# EAGLE design InkTime (EAGLE 9.7.0)

## Sheet 1 of 2
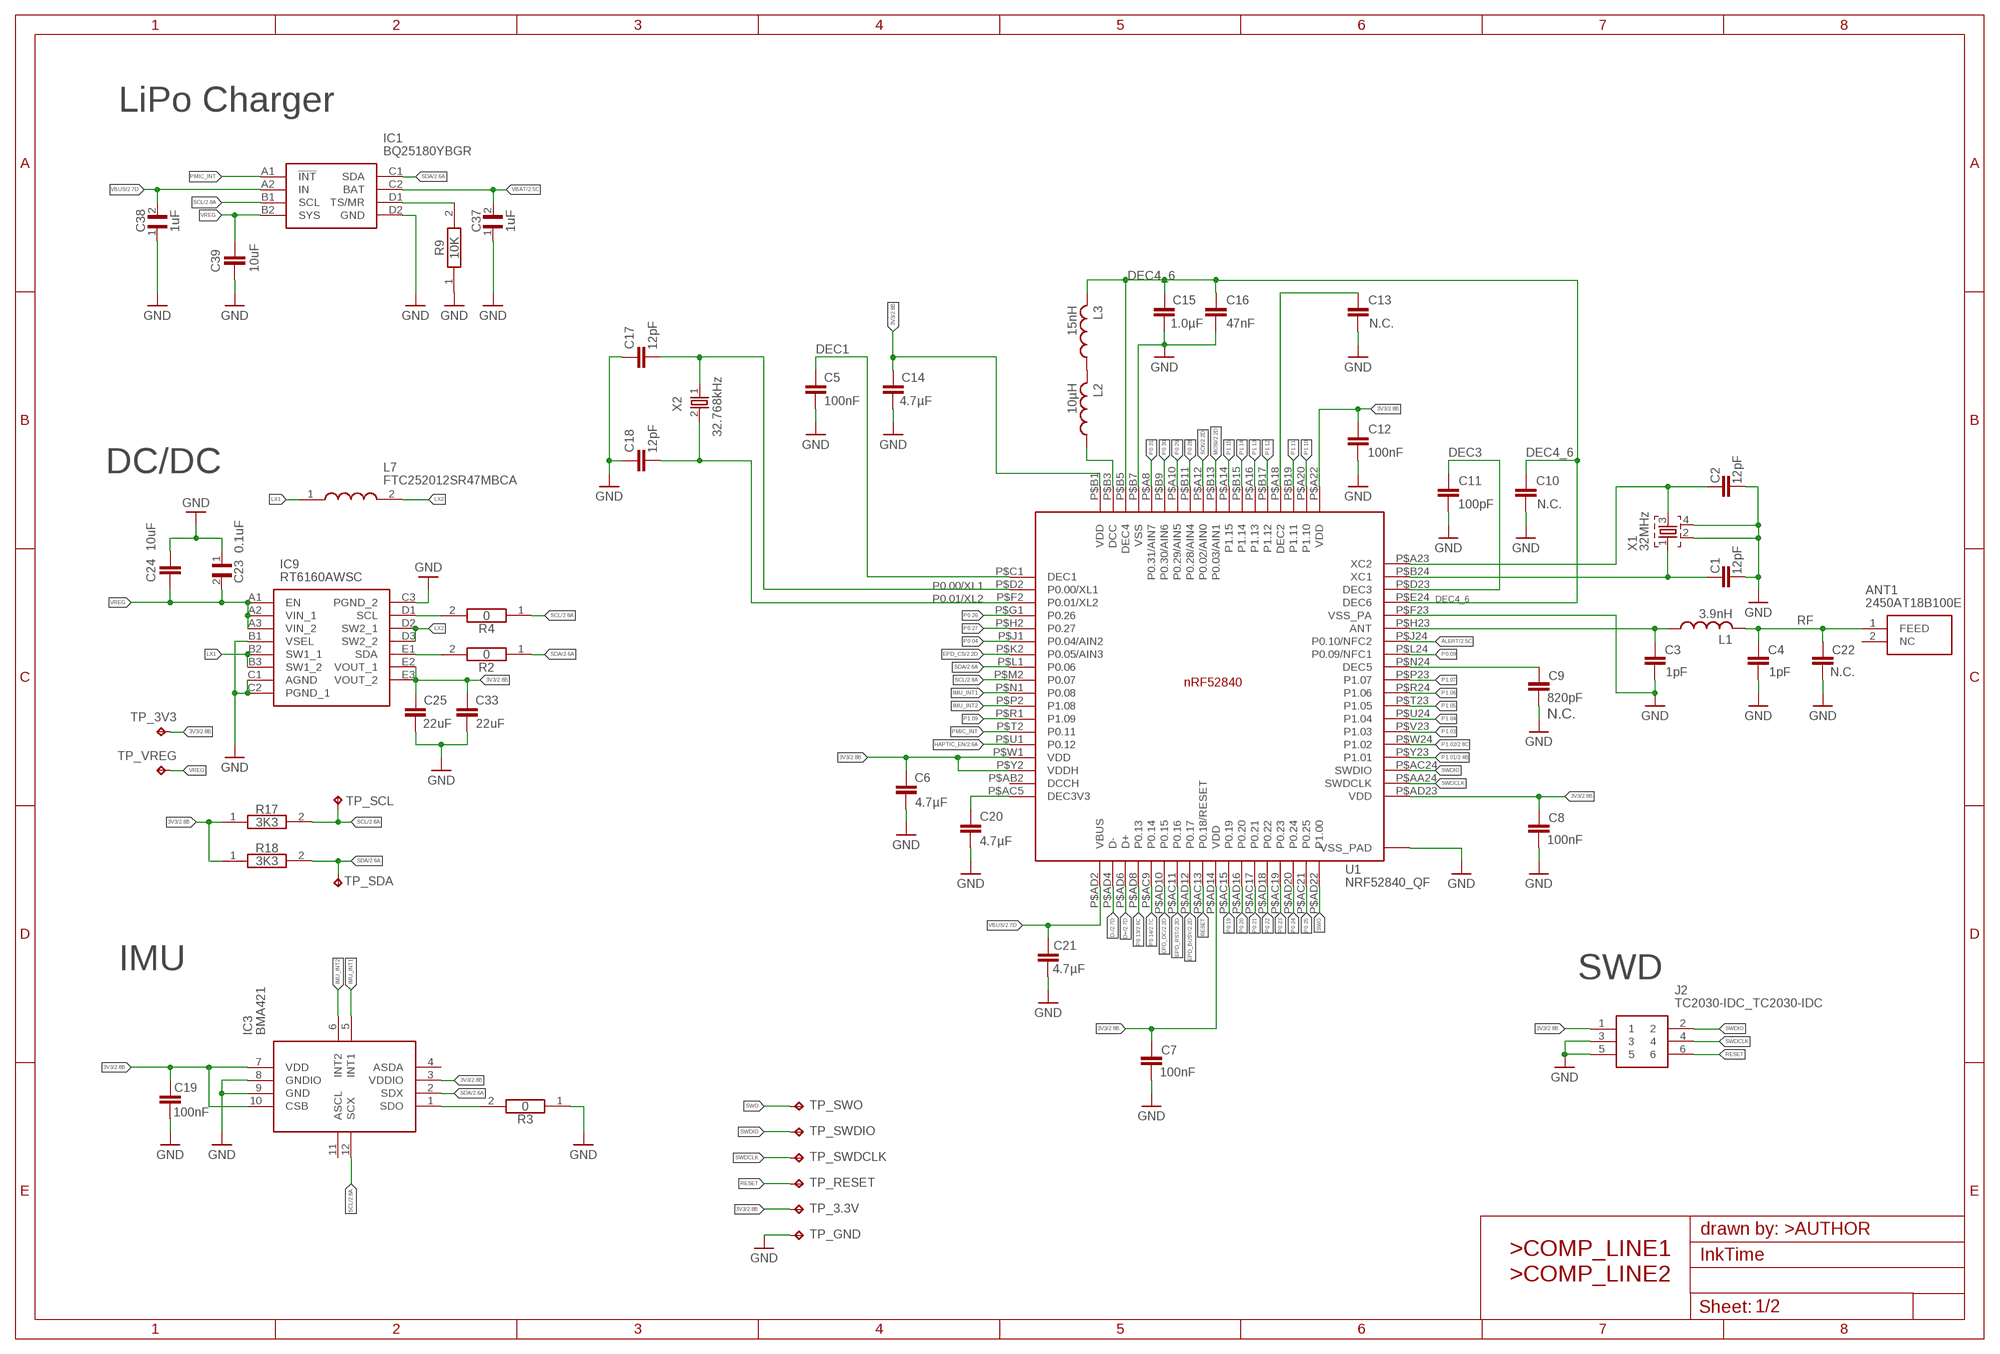
[diagram p0: schematic, sheet 1]
FRAME1 (FRAMES_A3L-LOC): AUTHOR: Robert Fabian Tudor; COMP_LINE1: MCU, Power,; COMP_LINE2: IMU, SWD

### Parts
ANT1  2450AT18B100E  2450AT18B100E_2450AT18B100E  [2450AT18B100E_ANTC3216X140N]
C1  12pF  NORDIC_NRF_3_CAPACITOR_0201_L  [NORDIC_NRF_3_RESC0201_L]
C2  12pF  NORDIC_NRF_3_CAPACITOR_0201_L  [NORDIC_NRF_3_RESC0201_L]
C3  1pF  NORDIC_NRF_3_CAPACITOR_0201_L  [NORDIC_NRF_3_RESC0201_L]
C4  1pF  NORDIC_NRF_3_CAPACITOR_0201_L  [NORDIC_NRF_3_RESC0201_L]
C5  100nF  NORDIC_NRF_3_CAPACITOR_0201_L  [NORDIC_NRF_3_RESC0201_L]
C6  4.7µF  NORDIC_NRF_3_CAPACITOR_0402_L  [NORDIC_NRF_3_RESC0402_L]
C7  100nF  NORDIC_NRF_3_CAPACITOR_0201_L  [NORDIC_NRF_3_RESC0201_L]
C8  100nF  NORDIC_NRF_3_CAPACITOR_0201_L  [NORDIC_NRF_3_RESC0201_L]
C9  820pF  NORDIC_NRF_3_CAPACITOR_0201_L  [NORDIC_NRF_3_RESC0201_L]
C10  N.C.  NORDIC_NRF_3_CAPACITOR_0201_L  [NORDIC_NRF_3_RESC0201_L]
C11  100pF  NORDIC_NRF_3_CAPACITOR_0201_L  [NORDIC_NRF_3_RESC0201_L]
C12  100nF  NORDIC_NRF_3_CAPACITOR_0201_L  [NORDIC_NRF_3_RESC0201_L]
C13  N.C.  NORDIC_NRF_3_CAPACITOR_0201_L  [NORDIC_NRF_3_RESC0201_L]
C14  4.7µF  NORDIC_NRF_3_CAPACITOR_0402_L  [NORDIC_NRF_3_RESC0402_L]
C15  1.0µF  NORDIC_NRF_3_CAPACITOR_0402_L  [NORDIC_NRF_3_RESC0402_L]
C16  47nF  NORDIC_NRF_3_CAPACITOR_0201_L  [NORDIC_NRF_3_RESC0201_L]
C17  12pF  NORDIC_NRF_3_CAPACITOR_0201_L  [NORDIC_NRF_3_RESC0201_L]
C18  12pF  NORDIC_NRF_3_CAPACITOR_0201_L  [NORDIC_NRF_3_RESC0201_L]
C19  100nF  NORDIC_NRF_3_CAPACITOR_0201_L  [NORDIC_NRF_3_RESC0201_L]
C20  4.7µF  NORDIC_NRF_3_CAPACITOR_0402_L  [NORDIC_NRF_3_RESC0402_L]
C21  4.7µF  NORDIC_NRF_3_CAPACITOR_0402_L  [NORDIC_NRF_3_RESC0402_L]
C22  N.C.  NORDIC_NRF_3_CAPACITOR_0201_L  [NORDIC_NRF_3_RESC0201_L]
C23  0.1uF  GRM011R60J152KE01L_1_GRM011R60J152KE01L  [GRM011R60J152KE01L_1_0201]
C24  10uF  NORDIC_NRF_3_CAPACITOR_0402_L  [NORDIC_NRF_3_RESC0402_L]
C25  22uF  NORDIC_NRF_3_CAPACITOR_0402_L  [NORDIC_NRF_3_RESC0402_L]
C33  22uF  NORDIC_NRF_3_CAPACITOR_0402_L  [NORDIC_NRF_3_RESC0402_L]
C37  1uF  GRM011R60J152KE01L_1_GRM011R60J152KE01L  [GRM011R60J152KE01L_1_0201]
C38  1uF  GRM011R60J152KE01L_1_GRM011R60J152KE01L  [GRM011R60J152KE01L_1_0201]
C39  10uF  NORDIC_NRF_3_CAPACITOR_0402_L  [NORDIC_NRF_3_RESC0402_L]
IC1  BQ25180YBGR  BQ25180YBGR_BQ25180YBGR  [BQ25180YBGR_BGA8C40P2X4_100X155X50]
IC3  BMA421  BMA423_BMA423  [BMA423_BMA423]
IC9  RT6160AWSC  RT6160AWSC_RT6160AWSC  [RT6160AWSC_BGA15C40P3X5_140X230X60]
J2  TC2030-IDC_TC2030-IDC  [TC2030-IDC_TC2030IDC]
L1  3.9nH  NORDIC_NRF_2_INDUCTOR_0402_L  [NORDIC_NRF_2_RESC0402_L]
L2  10µH  NORDIC_NRF_2_INDUCTOR_0402_L  [NORDIC_NRF_2_RESC0402_L]
L3  15nH  NORDIC_NRF_2_INDUCTOR_0402_L  [NORDIC_NRF_2_RESC0402_L]
L7  FTC252012SR47MBCA  MLP2016SR47MT0S1_FTC252012SR47MBCA  [MLP2016SR47MT0S1_INDC2016X100N]
R2  0  CPF0201D7K68C1_CPF0201D7K68C1  [CPF0201D7K68C1_0201]
R3  0  CPF0201D7K68C1_CPF0201D7K68C1  [CPF0201D7K68C1_0201]
R4  0  CPF0201D7K68C1_CPF0201D7K68C1  [CPF0201D7K68C1_0201]
R9  10K  CPF0201D7K68C1_CPF0201D7K68C1  [CPF0201D7K68C1_0201]
R17  3K3  CPF0201D7K68C1_CPF0201D7K68C1  [CPF0201D7K68C1_0201]
R18  3K3  CPF0201D7K68C1_CPF0201D7K68C1  [CPF0201D7K68C1_0201]
TP_3.3V  HECTOR_WATCH_1_TPTP20R  [HECTOR_WATCH_1_TP20R]
TP_3V3  HECTOR_WATCH_1_TPTP20R  [HECTOR_WATCH_1_TP20R]
TP_GND  HECTOR_WATCH_1_TPTP20R  [HECTOR_WATCH_1_TP20R]
TP_RESET  HECTOR_WATCH_1_TPTP20R  [HECTOR_WATCH_1_TP20R]
TP_SCL  HECTOR_WATCH_1_TPTP20R  [HECTOR_WATCH_1_TP20R]
TP_SDA  HECTOR_WATCH_1_TPTP20R  [HECTOR_WATCH_1_TP20R]
TP_SWDCLK  HECTOR_WATCH_1_TPTP20R  [HECTOR_WATCH_1_TP20R]
TP_SWDIO  HECTOR_WATCH_1_TPTP20R  [HECTOR_WATCH_1_TP20R]
TP_SWO  HECTOR_WATCH_1_TPTP20R  [HECTOR_WATCH_1_TP20R]
TP_VREG  HECTOR_WATCH_1_TPTP20R  [HECTOR_WATCH_1_TP20R]
U1  NRF52840_QF  NORDIC_NRF_4_NRF52840_QF  [NORDIC_NRF_4_AQFN50P700X700X85_HS-74N]
X1  32MHz  NORDIC_NRF_XTAL_32MHZ  [NORDIC_NRF_BT-XTAL_2016_N]
X2  32.768kHz  NORDIC_NRF_1_XTAL_32KHZ  [NORDIC_NRF_1_XTAL_3215_N]

### Nets
3V3: C6.1 C7.1 C8.1 C12.1 C14.1 C19.1 C25.1 C33.1 IC3.3(VDDIO) IC3.7(VDD) IC3.10(CSB) IC9.E2(VOUT_1) IC9.E3(VOUT_2) J2.1 R17.1 R18.1 TP_3.3V.TP TP_3V3.TP U1.P$A22(VDD) U1.P$AD14(VDD) U1.P$AD23(VDD) U1.P$B1(VDD) U1.P$W1(VDD) U1.P$Y2(VDDH) ; also sheet 2
ALERT: U1.P$J24(P0.10/NFC2) ; also sheet 2
D+: U1.P$AD6(D+) ; also sheet 2
D-: U1.P$AD4(D-) ; also sheet 2
EPD_BUSY: U1.P$AD12(P0.17) ; also sheet 2
EPD_CS: U1.P$K2(P0.05/AIN3) ; also sheet 2
EPD_DC: U1.P$AD10(P0.15) ; also sheet 2
EPD_RST: U1.P$AC11(P0.16) ; also sheet 2
GND: C1.2 C2.2 C3.2 C4.2 C5.2 C6.2 C7.2 C8.2 C9.2 C10.2 C11.2 C12.2 C13.2 C14.2 C15.2 C16.2 C17.1 C18.1 C19.2 C20.2 C21.2 C22.2 C23.1 C24.1 C25.2 C33.2 C37.1 C38.1 C39.2 IC1.D2(GND) IC3.8(GNDIO) IC3.9(GND) IC9.B1(VSEL) IC9.C1(AGND) IC9.C2(PGND_1) IC9.C3(PGND_2) J2.3 J2.5 R3.1 R9.1 TP_GND.TP U1.P$74(VSS_PAD) U1.P$75(VSS_PAD) U1.P$76(VSS_PAD) U1.P$77(VSS_PAD) U1.P$78(VSS_PAD) U1.P$79(VSS_PAD) U1.P$80(VSS_PAD) U1.P$81(VSS_PAD) U1.P$82(VSS_PAD) U1.P$83(VSS_PAD) U1.P$84(VSS_PAD) U1.P$85(VSS_PAD) U1.P$86(VSS_PAD) U1.P$87(VSS_PAD) U1.P$88(VSS_PAD) U1.P$89(VSS_PAD) U1.P$90(VSS_PAD) U1.P$B7(VSS) U1.P$F23(VSS_PA) X1.2 X1.4 ; also sheet 2
HAPTIC_EN: U1.P$U1(P0.12) ; also sheet 2
IMU_INT1: IC3.5(INT1) U1.P$N1(P0.08)
IMU_INT2: IC3.6(INT2) U1.P$P2(P1.08)
LX1: IC9.B2(SW1_1) IC9.B3(SW1_2) L7.1
LX2: IC9.D2(SW2_1) IC9.D3(SW2_2) L7.2
MOSI: U1.P$B13(P0.03/AIN1) ; also sheet 2
N$1: C9.1 U1.P$N24(DEC5)
N$2: C3.1 L1.1 U1.P$H23(ANT)
N$3: C13.1 U1.P$A18(DEC2)
N$4: L2.1 U1.P$B3(DCC)
N$6: IC1.D1(TS/MR) R9.2
N$7: C11.1 U1.P$D23(DEC3)
N$8: C1.1 U1.P$B24(XC1) X1.1
N$9: C2.1 U1.P$A23(XC2) X1.3
N$10: ANT1.1(FEED) C4.1 C22.1 L1.2
N$11: C10.1 C15.1 C16.1 L3.2 U1.P$B5(DEC4) U1.P$E24(DEC6)
N$12: L2.2 L3.1
N$13: C5.1 U1.P$C1(DEC1)
N$14: C17.2 U1.P$D2(P0.00/XL1) X2.1
N$15: C18.2 U1.P$F2(P0.01/XL2) X2.2
N$17: C20.1 U1.P$AC5(DEC3V3)
N$18: IC9.E1(SDA) R2.2
N$19: IC9.D1(SCL) R4.2
N$21: IC3.1(SDO) R3.2
P0.04: U1.P$J1(P0.04/AIN2)
P0.09: U1.P$L24(P0.09/NFC1)
P0.13: U1.P$AD8(P0.13) ; also sheet 2
P0.14: U1.P$AC9(P0.14) ; also sheet 2
P0.19: U1.P$AC15(P0.19)
P0.20: U1.P$AD16(P0.20)
P0.21: U1.P$AC17(P0.21)
P0.22: U1.P$AD18(P0.22)
P0.23: U1.P$AC19(P0.23)
P0.24: U1.P$AD20(P0.24)
P0.25: U1.P$AC21(P0.25)
P0.26: U1.P$G1(P0.26)
P0.27: U1.P$H2(P0.27)
P0.28: U1.P$B11(P0.28/AIN4)
P0.29: U1.P$A10(P0.29/AIN5)
P0.30: U1.P$B9(P0.30/AIN6)
P0.31: U1.P$A8(P0.31/AIN7)
P1.01: U1.P$Y23(P1.01) ; also sheet 2
P1.02: U1.P$W24(P1.02) ; also sheet 2
P1.03: U1.P$V23(P1.03)
P1.04: U1.P$U24(P1.04)
P1.05: U1.P$T23(P1.05)
P1.06: U1.P$R24(P1.06)
P1.07: U1.P$P23(P1.07)
P1.09: U1.P$R1(P1.09)
P1.10: U1.P$A20(P1.10)
P1.11: U1.P$B19(P1.11)
P1.12: U1.P$B17(P1.12)
P1.13: U1.P$A16(P1.13)
P1.14: U1.P$B15(P1.14)
P1.15: U1.P$A14(P1.15)
PMIC_INT: IC1.A1(!INT) U1.P$T2(P0.11)
RESET: J2.6 TP_RESET.TP U1.P$AC13(P0.18/RESET)
SCK: U1.P$A12(P0.02/AIN0) ; also sheet 2
SCL: IC1.B1(SCL) IC3.12(SCX) R4.1 R17.2 TP_SCL.TP U1.P$M2(P0.07) ; also sheet 2
SDA: IC1.C1(SDA) IC3.2(SDX) R2.1 R18.2 TP_SDA.TP U1.P$L1(P0.06) ; also sheet 2
SWDCLK: J2.4 TP_SWDCLK.TP U1.P$AA24(SWDCLK)
SWDIO: J2.2 TP_SWDIO.TP U1.P$AC24(SWDIO)
SWO: TP_SWO.TP U1.P$AD22(P1.00)
VBAT: C37.2 IC1.C2(BAT) ; also sheet 2
VBUS: C21.1 C38.2 IC1.A2(IN) U1.P$AD2(VBUS) ; also sheet 2
VREG: C23.2 C24.2 C39.1 IC1.B2(SYS) IC9.A1(EN) IC9.A2(VIN_1) IC9.A3(VIN_2) TP_VREG.TP
Unconnected: ANT1.2(NC) IC3.4(ASDA) IC3.11(ASCL) U1.P$AB2(DCCH)

### Notes on the sheet
- LiPo Charger
- DEC4_6
- DEC1
- DEC3 | DEC4_6
- DC/DC
- P0.00/XL1
- P0.01/XL2 | DEC4_6
- RF
- N.C.
- IMU | SWD

## Sheet 2 of 2
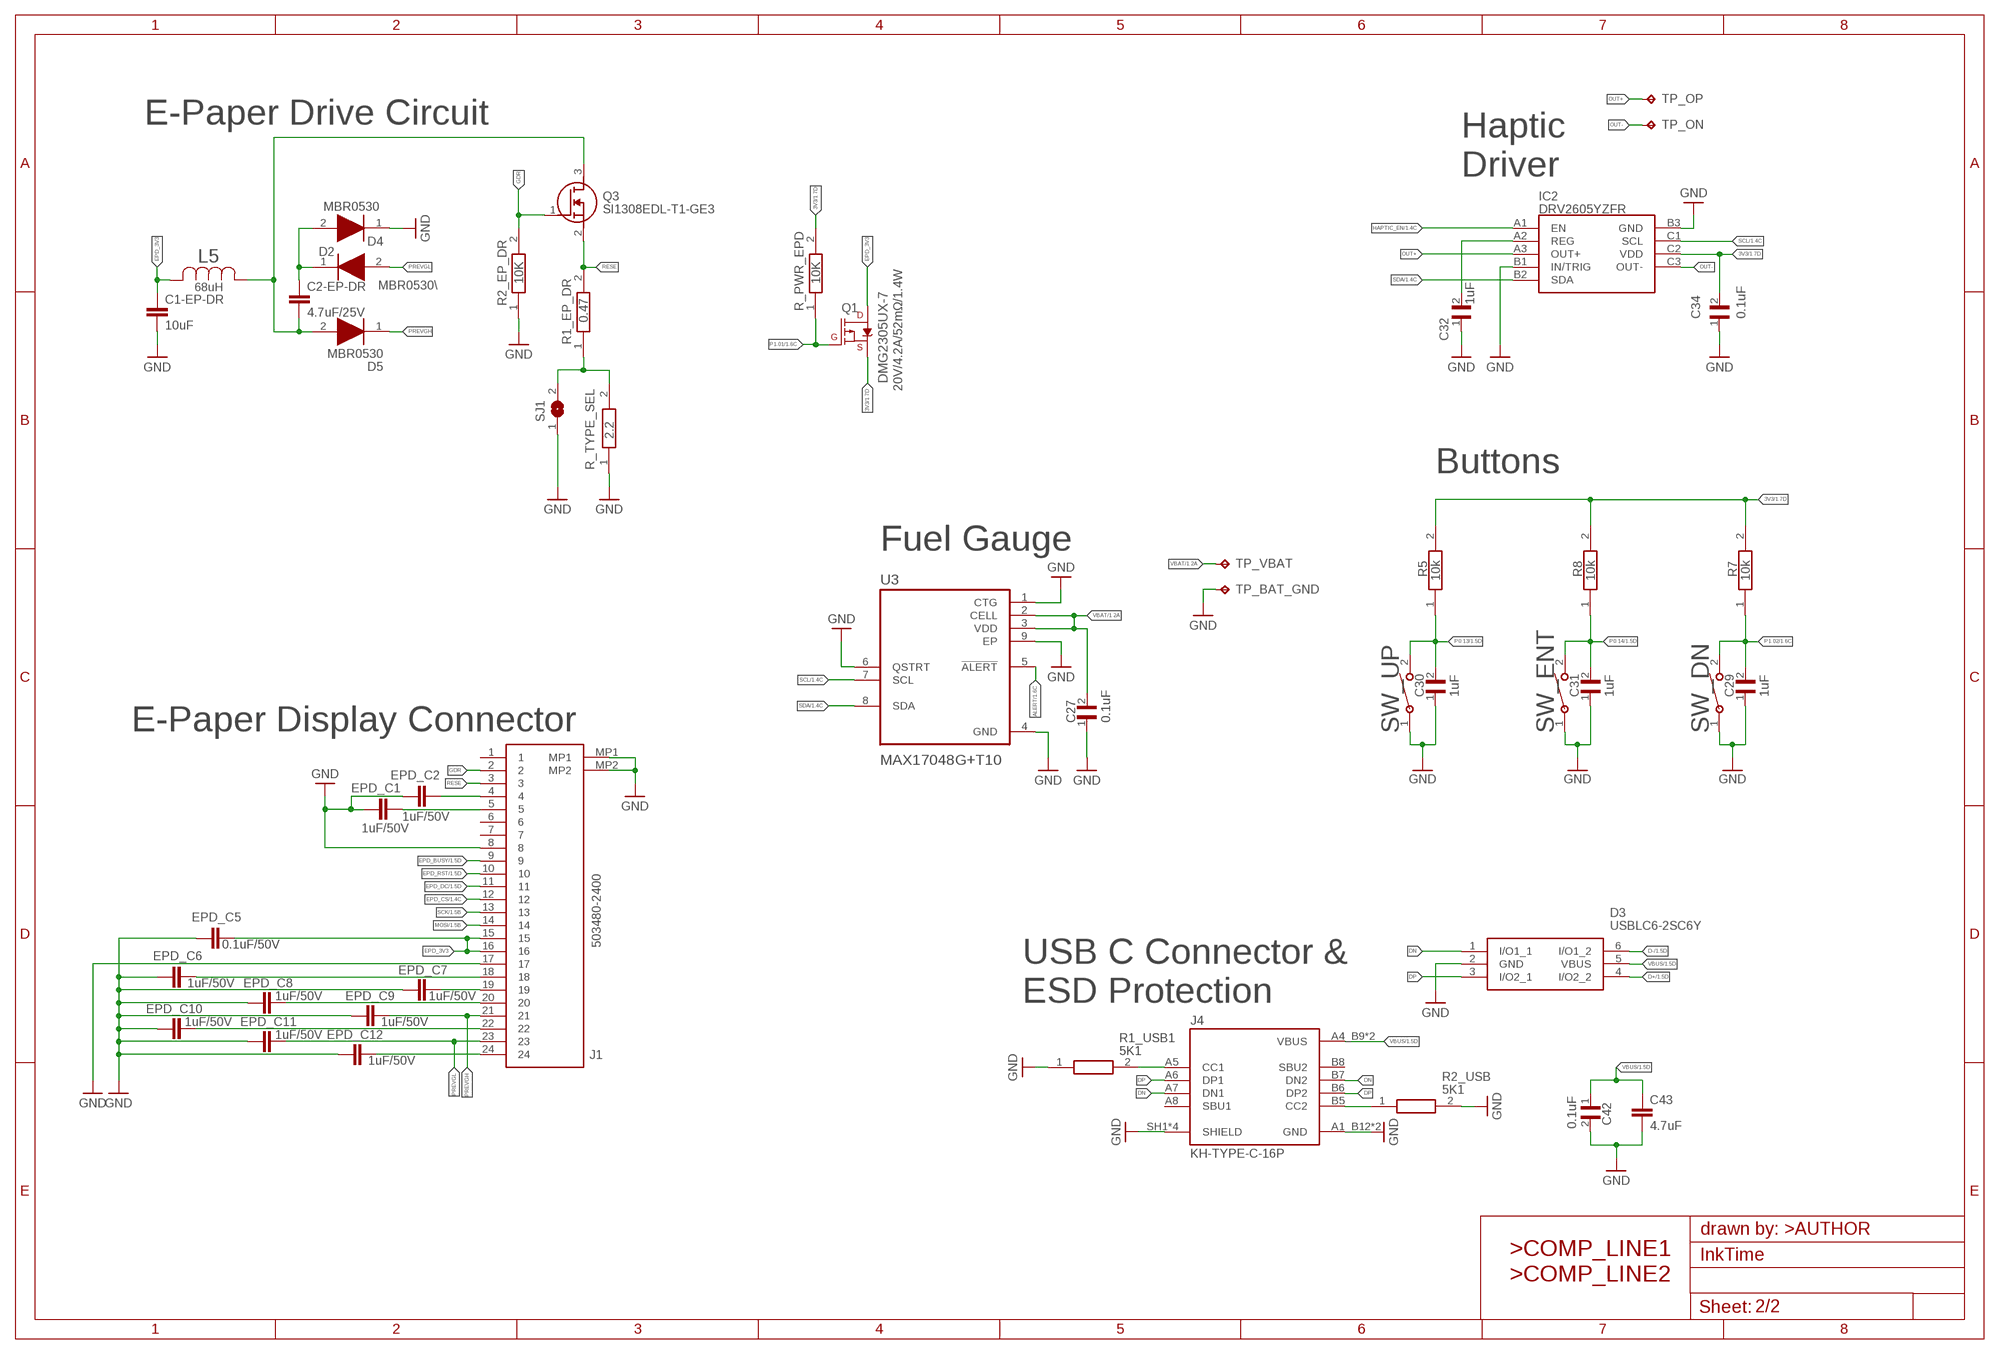
[diagram p1: schematic, sheet 2]
FRAME2 (FRAMES_A3L-LOC): AUTHOR: Robert Fabian Tudor; COMP_LINE1: E-Paper &; COMP_LINE2: Peripherals

### Parts
C1-EP-DR  10uF  NORDIC_NRF_3_CAPACITOR_0402_L  [NORDIC_NRF_3_RESC0402_L]
C2-EP-DR  4.7uF/25V  NORDIC_NRF_3_CAPACITOR_0402_L  [NORDIC_NRF_3_RESC0402_L]
C27  0.1uF  GRM011R60J152KE01L_1_GRM011R60J152KE01L  [GRM011R60J152KE01L_1_0201]
C29  1uF  GRM011R60J152KE01L_1_GRM011R60J152KE01L  [GRM011R60J152KE01L_1_0201]
C30  1uF  GRM011R60J152KE01L_1_GRM011R60J152KE01L  [GRM011R60J152KE01L_1_0201]
C31  1uF  GRM011R60J152KE01L_1_GRM011R60J152KE01L  [GRM011R60J152KE01L_1_0201]
C32  1uF  GRM011R60J152KE01L_1_GRM011R60J152KE01L  [GRM011R60J152KE01L_1_0201]
C34  0.1uF  GRM011R60J152KE01L_1_GRM011R60J152KE01L  [GRM011R60J152KE01L_1_0201]
C42  0.1uF  GRM011R60J152KE01L_1_GRM011R60J152KE01L  [GRM011R60J152KE01L_1_0201]
C43  4.7uF  NORDIC_NRF_3_CAPACITOR_0402_L  [NORDIC_NRF_3_RESC0402_L]
D2  MBR0530\  ESP32_C6_LIBRARY_5_MBR0530  [ESP32_C6_LIBRARY_5_SOD3716X135N]
D3  USBLC6-2SC6Y  ESP32_C6_LIBRARY_3_USBLC6-2SC6Y  [ESP32_C6_LIBRARY_3_SOT95P280X145-6N]
D4  MBR0530  ESP32_C6_LIBRARY_5_MBR0530  [ESP32_C6_LIBRARY_5_SOD3716X135N]
D5  MBR0530  ESP32_C6_LIBRARY_5_MBR0530  [ESP32_C6_LIBRARY_5_SOD3716X135N]
EPD_C1  1uF/50V  NORDIC_NRF_3_CAPACITOR_0402_L  [NORDIC_NRF_3_RESC0402_L]
EPD_C2  1uF/50V  NORDIC_NRF_3_CAPACITOR_0402_L  [NORDIC_NRF_3_RESC0402_L]
EPD_C5  0.1uF/50V  NORDIC_NRF_3_CAPACITOR_0201_L  [NORDIC_NRF_3_RESC0201_L]
EPD_C6  1uF/50V  NORDIC_NRF_3_CAPACITOR_0402_L  [NORDIC_NRF_3_RESC0402_L]
EPD_C7  1uF/50V  NORDIC_NRF_3_CAPACITOR_0402_L  [NORDIC_NRF_3_RESC0402_L]
EPD_C8  1uF/50V  NORDIC_NRF_3_CAPACITOR_0402_L  [NORDIC_NRF_3_RESC0402_L]
EPD_C9  1uF/50V  NORDIC_NRF_3_CAPACITOR_0402_L  [NORDIC_NRF_3_RESC0402_L]
EPD_C10  1uF/50V  NORDIC_NRF_3_CAPACITOR_0402_L  [NORDIC_NRF_3_RESC0402_L]
EPD_C11  1uF/50V  NORDIC_NRF_3_CAPACITOR_0402_L  [NORDIC_NRF_3_RESC0402_L]
EPD_C12  1uF/50V  NORDIC_NRF_3_CAPACITOR_0402_L  [NORDIC_NRF_3_RESC0402_L]
IC2  DRV2605YZFR  DRV2605YZFR_DRV2605YZFR  [DRV2605YZFR_BGA9C50P3X3_144X144X62]
J1  503480-2400  503480-2400_503480-2400  [503480-2400_5034802400]
J4  KH-TYPE-C-16P  KH-TYPE-C-16P_KH-TYPE-C-16P  [KH-TYPE-C-16P_KINGHELM_KH-TYPE-C-16P]
L5  68uH  ESP32_C6_LIBRARY_2_744043680IND_4828-WE-TPC_WRE  [ESP32_C6_LIBRARY_2_IND_4828-WE-TPC_WRE]
Q1  20V/4.2A/52mΩ/1.4W  ESP32_C6_LIBRARY_4_ESP32_WROVER_SPARKFUN-DISCRETESEMI_MOSFET_PCH-DMG2305UX-7  [ESP32_C6_LIBRARY_4_ESP32_C6_LIBRARY_4_ESP32_C6_LIBRARY_4_ESP32_C6_LIBRARY_4_ESP32_WROVER_SPARKFUN-DISCRETESEMI_SOT23-3]
Q3  SI1308EDL-T1-GE3  ESP32_C6_LIBRARY_6_SI1308EDL-T1-GE3  [ESP32_C6_LIBRARY_6_SOT65P210X110-3N]
R1_EP_DR  0.47  CPF0201D7K68C1_CPF0201D7K68C1  [CPF0201D7K68C1_0201]
R1_USB1  5K1  CPF0201D7K68C1_CPF0201D7K68C1  [CPF0201D7K68C1_0201]
R2_EP_DR  10K  CPF0201D7K68C1_CPF0201D7K68C1  [CPF0201D7K68C1_0201]
R2_USB  5K1  CPF0201D7K68C1_CPF0201D7K68C1  [CPF0201D7K68C1_0201]
R5  10k  CPF0201D7K68C1_CPF0201D7K68C1  [CPF0201D7K68C1_0201]
R7  10k  CPF0201D7K68C1_CPF0201D7K68C1  [CPF0201D7K68C1_0201]
R8  10k  CPF0201D7K68C1_CPF0201D7K68C1  [CPF0201D7K68C1_0201]
R_PWR_EPD  10K  CPF0201D7K68C1_CPF0201D7K68C1  [CPF0201D7K68C1_0201]
R_TYPE_SEL  2.2  CPF0201D7K68C1_CPF0201D7K68C1  [CPF0201D7K68C1_0201]
SJ1  ESP32_C6_LIBRARY_7_JUMPER_SJ  [ESP32_C6_LIBRARY_7_JUMPER_SJ]
SW_DN  2025-10-22_07-23-44_LIBRARY_EVP-AKE31ASW_EVP-AKE31A_PAN  [2025-10-22_07-23-44_LIBRARY_SW_EVP-AKE31A_PAN]
SW_ENT  2025-10-22_07-23-44_LIBRARY_EVP-AKE31ASW_EVP-AKE31A_PAN  [2025-10-22_07-23-44_LIBRARY_SW_EVP-AKE31A_PAN]
SW_UP  2025-10-22_07-23-44_LIBRARY_EVP-AKE31ASW_EVP-AKE31A_PAN  [2025-10-22_07-23-44_LIBRARY_SW_EVP-AKE31A_PAN]
TP_BAT_GND  HECTOR_WATCH_1_TPTP20R  [HECTOR_WATCH_1_TP20R]
TP_ON  HECTOR_WATCH_1_TPTP20R  [HECTOR_WATCH_1_TP20R]
TP_OP  HECTOR_WATCH_1_TPTP20R  [HECTOR_WATCH_1_TP20R]
TP_VBAT  HECTOR_WATCH_1_TPTP20R  [HECTOR_WATCH_1_TP20R]
U3  MAX17048G+T10  ESP32_C6_LIBRARY_MAX17048G+T10  [ESP32_C6_LIBRARY_SON50P200X200X80-9N]

### Nets
3V3: C34.2 IC2.C2(VDD) Q1.2(S) R5.2 R7.2 R8.2 R_PWR_EPD.2 ; also sheet 1
ALERT: U3.5(!ALERT) ; also sheet 1
D+: D3.4(I/O2_2) ; also sheet 1
D-: D3.6(I/O1_2) ; also sheet 1
DN: D3.1(I/O1_1) J4.A7(DN1) J4.B7(DN2)
DP: D3.3(I/O2_1) J4.A6(DP1) J4.B6(DP2)
EPD_3V3: C1-EP-DR.2 EPD_C5.2 J1.15 J1.16 L5.2 Q1.3(D)
EPD_BUSY: J1.9 ; also sheet 1
EPD_CS: J1.12 ; also sheet 1
EPD_DC: J1.11 ; also sheet 1
EPD_RST: J1.10 ; also sheet 1
GDR: J1.2 Q3.1(G) R2_EP_DR.2
GND: C1-EP-DR.1 C27.1 C29.1 C30.1 C31.1 C32.1 C34.1 C42.2 C43.2 D3.2(GND) D4.1(K) EPD_C1.1 EPD_C2.1 EPD_C5.1 EPD_C6.1 EPD_C7.1 EPD_C8.1 EPD_C9.1 EPD_C10.1 EPD_C11.1 EPD_C12.1 IC2.B1(IN/TRIG) IC2.B3(GND) J1.8 J1.17 J1.MP1 J1.MP2 J4.A1_B12(GND) J4.A12_B1(GND) J4.SH1(SHIELD) J4.SH2(SHIELD) J4.SH3(SHIELD) J4.SH4(SHIELD) R1_USB1.1 R2_EP_DR.1 R2_USB.2 R_TYPE_SEL.1 SJ1.1 SW_DN.1 SW_ENT.1 SW_UP.1 TP_BAT_GND.TP U3.1(CTG) U3.4(GND) U3.6(QSTRT) U3.9(EP) ; also sheet 1
HAPTIC_EN: IC2.A1(EN) ; also sheet 1
MOSI: J1.14 ; also sheet 1
N$5: C32.2 IC2.A2(REG)
N$20: J4.B5(CC2) R2_USB.1
N$22: J4.A5(CC1) R1_USB1.2
N$23: EPD_C2.2 J1.4
N$24: EPD_C6.2 J1.18
N$25: EPD_C1.2 J1.5
N$26: EPD_C7.2 J1.19
N$27: EPD_C8.2 J1.20
N$29: EPD_C10.2 J1.22
N$31: EPD_C12.2 J1.24
N$32: C2-EP-DR.1 D5.2(A) L5.1 Q3.3(D)
N$33: R1_EP_DR.1 R_TYPE_SEL.2 SJ1.2
N$34: C2-EP-DR.2 D2.1(K) D4.2(A)
OUT+: IC2.A3(OUT+) TP_OP.TP
OUT-: IC2.C3(OUT-) TP_ON.TP
P0.13: C30.2 R5.1 SW_UP.2 ; also sheet 1
P0.14: C31.2 R8.1 SW_ENT.2 ; also sheet 1
P1.01: Q1.1(G) R_PWR_EPD.1 ; also sheet 1
P1.02: C29.2 R7.1 SW_DN.2 ; also sheet 1
PREVGH: D5.1(K) EPD_C9.2 J1.21
PREVGL: D2.2(A) EPD_C11.2 J1.23
RESE: J1.3 Q3.2(S) R1_EP_DR.2
SCK: J1.13 ; also sheet 1
SCL: IC2.C1(SCL) U3.7(SCL) ; also sheet 1
SDA: IC2.B2(SDA) U3.8(SDA) ; also sheet 1
VBAT: C27.2 TP_VBAT.TP U3.2(CELL) U3.3(VDD) ; also sheet 1
VBUS: C42.1 C43.1 D3.5(VBUS) J4.A4_B9(VBUS) J4.A9_B4(VBUS) ; also sheet 1
Unconnected: J1.1 J1.6 J1.7 J4.A8(SBU1) J4.B8(SBU2)

### Notes on the sheet
- E-Paper Drive Circuit
- Haptic
  Driver
- DMG2305UX-7
- Buttons
- Fuel Gauge
- E-Paper Display Connector
- USB C Connector & 
  ESD Protection

## Library data of the parts
ANT1 = Library_Project_TSC:2450AT18B100E_2450AT18B100E: Antennas 2.45GHz ANTENNA Source: Datasheet <https://www.johansontechnology.com/datasheets/2450AT18B100/2450AT18B100.pdf>
C1 C1-EP-DR C2 C2-EP-DR C3-C22 C24 C25 C33 C39 C43 EPD_C1 EPD_C2 EPD_C5-EPD_C12 = Library_Project_TSC:NORDIC_NRF_3_CAPACITOR: Generic chip capacitor
C23 C27 C29-C32 C34 C37 C38 C42 = Library_Project_TSC:GRM011R60J152KE01L_1_GRM011R60J152KE01L: Check availability <https://pricing.snapeda.com/parts/GRM011R60J152KE01L/Murata/view-part?ref=eda>
D2 D4 D5 = Library_Project_TSC:ESP32_C6_LIBRARY_5_MBR0530: ON SEMICONDUCTOR - MBR0530 - DIODE, SCHOTTKY, 0.5A, 30V, SOD-123 Source: Datasheet <http://www.onsemi.com/pub/Collateral/MBR0530T1-D.PDF> Check availability <https://pricing.snapeda.com/parts/MBR0530/ON%20Semiconductor/view-part?ref=eda>
D3 = Library_Project_TSC:ESP32_C6_LIBRARY_3_USBLC6-2SC6Y: Low Cap. ESD Protection Auto SOT-23-6 STMicroelectronics USBLC6-2SC6Y, Dual Uni-Directional TVS Diode Array, 6-Pin SOT-23 Source: Datasheet <https://componentsearchengine.com/Datasheets/1/USBLC6-2SC6Y.pdf> Check availability <https://pricing.snapeda.com/parts/USBLC6-2SC6Y/STMicroelectronics/view-part?ref=eda>
IC1 = Library_Project_TSC:BQ25180YBGR_BQ25180YBGR: Charger IC Lithium Ion/Polymer, Lithium Iron Phosphate 8-DSBGA (1.6x1.1) Source: Datasheet <https://www.ti.com/lit/ds/symlink/bq25180.pdf?ts=1650264094470&ref_url=https%3A%2F%2Fwww.ti.com%2Fproduct%2FBQ25180>
IC2 = Library_Project_TSC:DRV2605YZFR_DRV2605YZFR: Haptic Driver for ERM/LRA with Built-In Library and Smart Loop Architecture Source: Datasheet <http://www.ti.com/lit/gpn/drv2605>
IC3 = Library_Project_TSC:BMA423_BMA423: Accelerometers Triaxial low-g 12bit Acceleration Sensor Source: Datasheet <https://www.mouser.com/datasheet/2/783/BST-BMA423-DS000-1509600.pdf>
IC9 = Library_Project_TSC:RT6160AWSC_RT6160AWSC: Buck-Boost Regulator Positive Output Step-Up/Step-Down I2C DC-DC Controller IC 15-WL-CSP (BSC) (1.4x2.3) Source: Datasheet <https://www.richtek.com/SaveDownload.aspx?specid=RT6160A>
J1 = Library_Project_TSC:503480-2400_503480-2400: FFC & FPC Connectors 0.5mm FPC RA SMT Dual Contact 24Ckt Source: Datasheet <https://componentsearchengine.com/Datasheets/1/503480-2400.pdf>
J2 = Library_Project_TSC:TC2030-IDC_TC2030-IDC: CABLE ADAPTER 6 POS Source: Datasheet <https://datasheet.datasheetarchive.com/originals/distributors/Datasheets_SAMA/62bc384e093448baaaa63dbd0b9d8707.pdf>
J4 = Library_Project_TSC:KH-TYPE-C-16P_KH-TYPE-C-16P: Check availability <https://pricing.snapeda.com/parts/KH-TYPE-C-16P/kinghelm/view-part?ref=eda>
L1-L3 = Library_Project_TSC:NORDIC_NRF_2_INDUCTOR: Generic chip inductor
L5 = Library_Project_TSC:ESP32_C6_LIBRARY_2_744043680
L7 = Library_Project_TSC:MLP2016SR47MT0S1_FTC252012SR47MBCA: SMD / SMT Inductors (Coils), L=0.47?H, L x W x T : Source: Datasheet <https://product.tdk.com/system/files/dam/doc/product/inductor/inductor/smd/catalog/inductor_commercial_power_mlp2016_en.pdf>
Q1 = Library_Project_TSC:ESP32_C6_LIBRARY_4_ESP32_WROVER_SPARKFUN-DISCRETESEMI_MOSFET_PCH: P-channel MOSFETs Voltage controlled devices that allow control of high current outputs. SparkFun Products: SparkFun ESP32 Thing <https://www.sparkfun.com/products/13907> SparkFun ESP8266 Thing <https://www.sparkfun.com/products/13231> SparkFun Pi Servo HAT V2 <https://www.sparkfun.com/products/15316> DMG2305UX-7 (20V/4.2A/SOT23-3)
Q3 = Library_Project_TSC:ESP32_C6_LIBRARY_6_SI1308EDL-T1-GE3: MOSFET N-Ch 30V 1.5A TrenchFET SC70 Vishay Si1308EDL-T1-GE3 N-channel MOSFET Transistor, 1.5 A, 30 V, 3-Pin SC-70 Source: Datasheet <https://componentsearchengine.com/Datasheets/1/SI1308EDL-T1-GE3.pdf> Check availability <https://pricing.snapeda.com/parts/SI1308EDL-T1-GE3/Vishay%20Siliconix/view-part?ref=eda>
R1_EP_DR R1_USB1 R2 R2_EP_DR R2_USB R3-R5 R7-R9 R17 R18 R_PWR_EPD R_TYPE_SEL = Library_Project_TSC:CPF0201D7K68C1_CPF0201D7K68C1: 7.68k 0201 Thin Film Surface Mount Fixed Resistor +/-0.5% 0.031W CPF0201D7K68C1 Source: Datasheet <http://www.te.com/commerce/DocumentDelivery/DDEController?Action=showdoc&DocId=Data Sheet1773200-1ApdfEnglishENG_DS_1773200-1_A.pdf4-2176215-6>
SJ1 = Library_Project_TSC:ESP32_C6_LIBRARY_7_JUMPER_SJ: SMD solder JUMPER
SW_DN SW_ENT SW_UP = Library_Project_TSC:2025-10-22_07-23-44_LIBRARY_EVP-AKE31A
TP_3.3V TP_3V3 TP_BAT_GND TP_GND TP_ON TP_OP TP_RESET TP_SCL TP_SDA TP_SWDCLK TP_SWDIO TP_SWO TP_VBAT TP_VREG = Library_Project_TSC:HECTOR_WATCH_1_TP: Test pad
U1 = Library_Project_TSC:NORDIC_NRF_4_NRF52840_QF: nRF52840 Features Advanced Single chip 2.4 GHz multi-protocol SoC 32-bit ARM Cortex-M4F Processor 1.7v to 5.5v operation 1MB flash + 256kB RAM Bluetooth 5 support for long range and high throughput 802.15.4 radio support On-chip NFC PPI –Programmable Peripheral Interconnect Automated power management system with automatic power management of each peripheral Configurable I/O mapping for analog and digital I/O 48 x GPIO 1 x QSPI 4 x Master/Slave SPI 2 x Two-wire interface (I²C) I²S interface 2 x UART 4 x PWM USB 2.0 controller ARM TrustZone CryptoCell-310 Cryptographic and security module AES 128-bit ECB/CCM/AAR hardware accelerator Digital microphone interface (PDM) Quadrature decoder 12-bit ADC Low power comparator On-chip 50Ω balun On-air compatible with nRF52, nRF51 and nRF24 Series Applications Advanced high performance wearables Wearables for secure payments Virtual Reality/Augmented Reality systems Smart Home sensor networks Smart city sensor networks High performance HID controllers Internet of Things (IoT) sensor networks Smart door locks Smart lighting networks Connected white goods
U3 = Library_Project_TSC:ESP32_C6_LIBRARY_MAX17048G+T10: Check availability <https://pricing.snapeda.com/parts/MAX17048G%2BT10/Analog%20Devices/view-part?ref=eda>
X1 = Library_Project_TSC:NORDIC_NRF_XTAL_32MHZ
X2 = Library_Project_TSC:NORDIC_NRF_1_XTAL_32KHZ

## Board
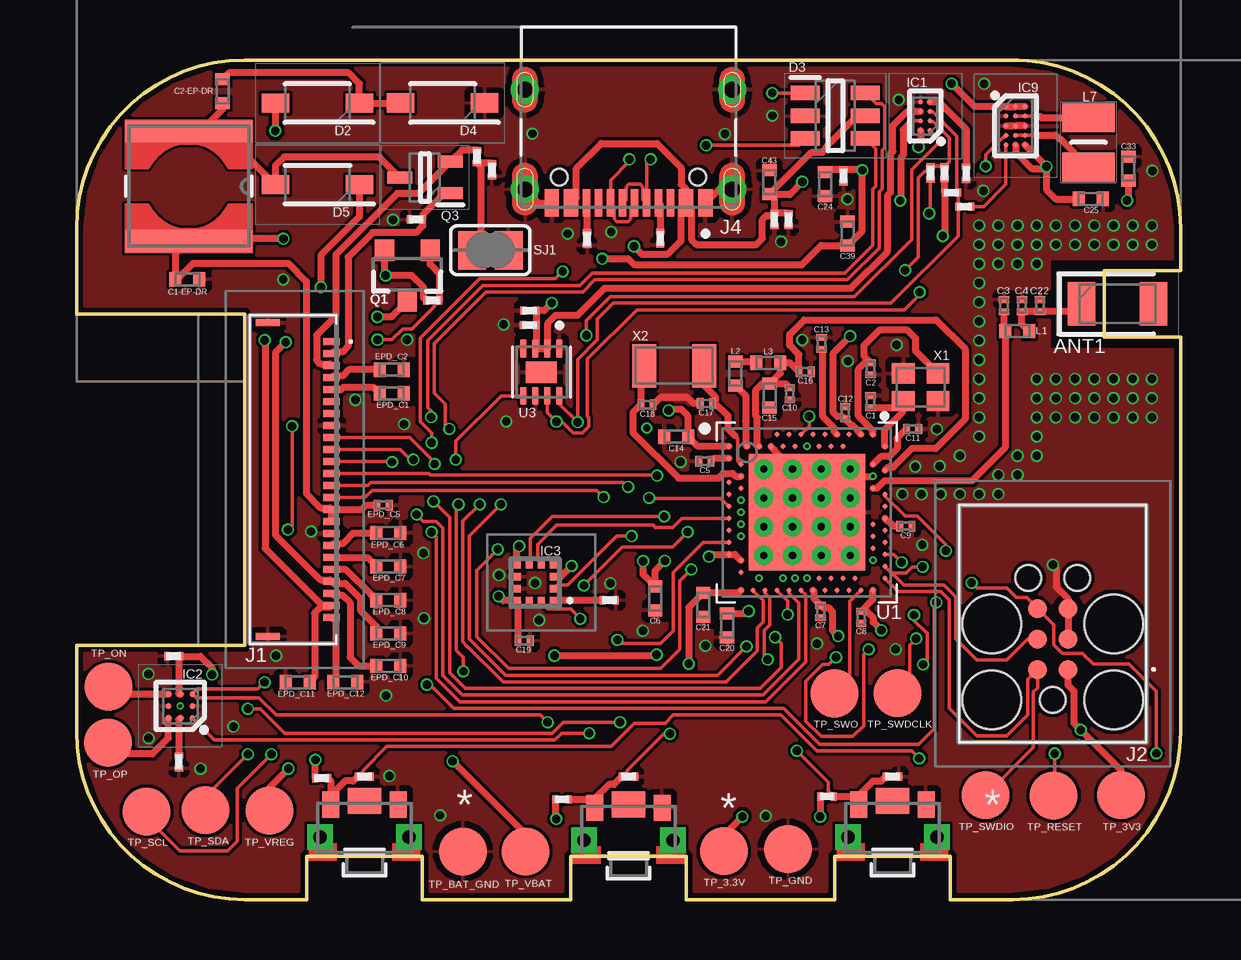
[diagram p2: board, top side]
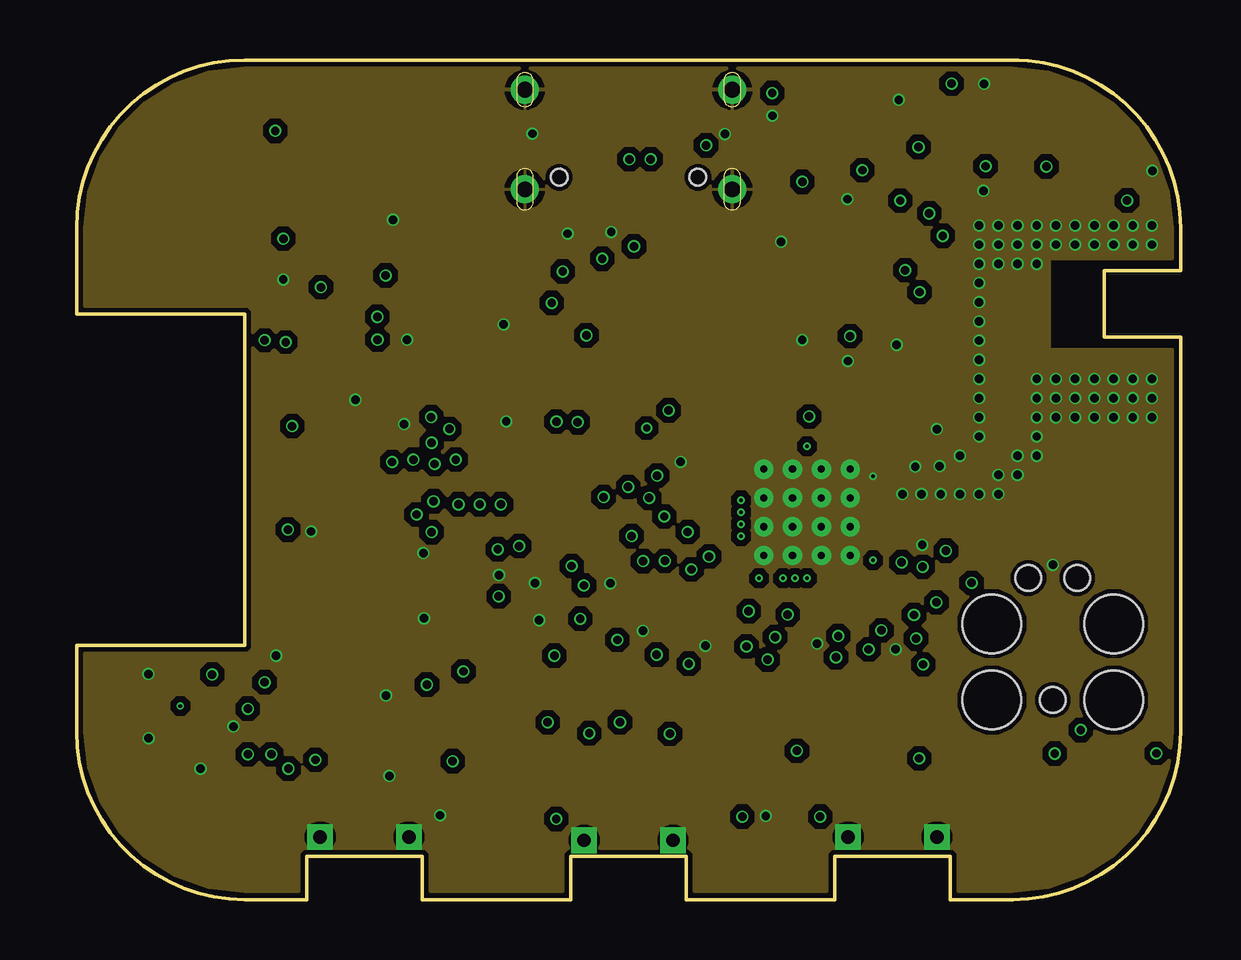
[diagram p3: board, inner layer GND]
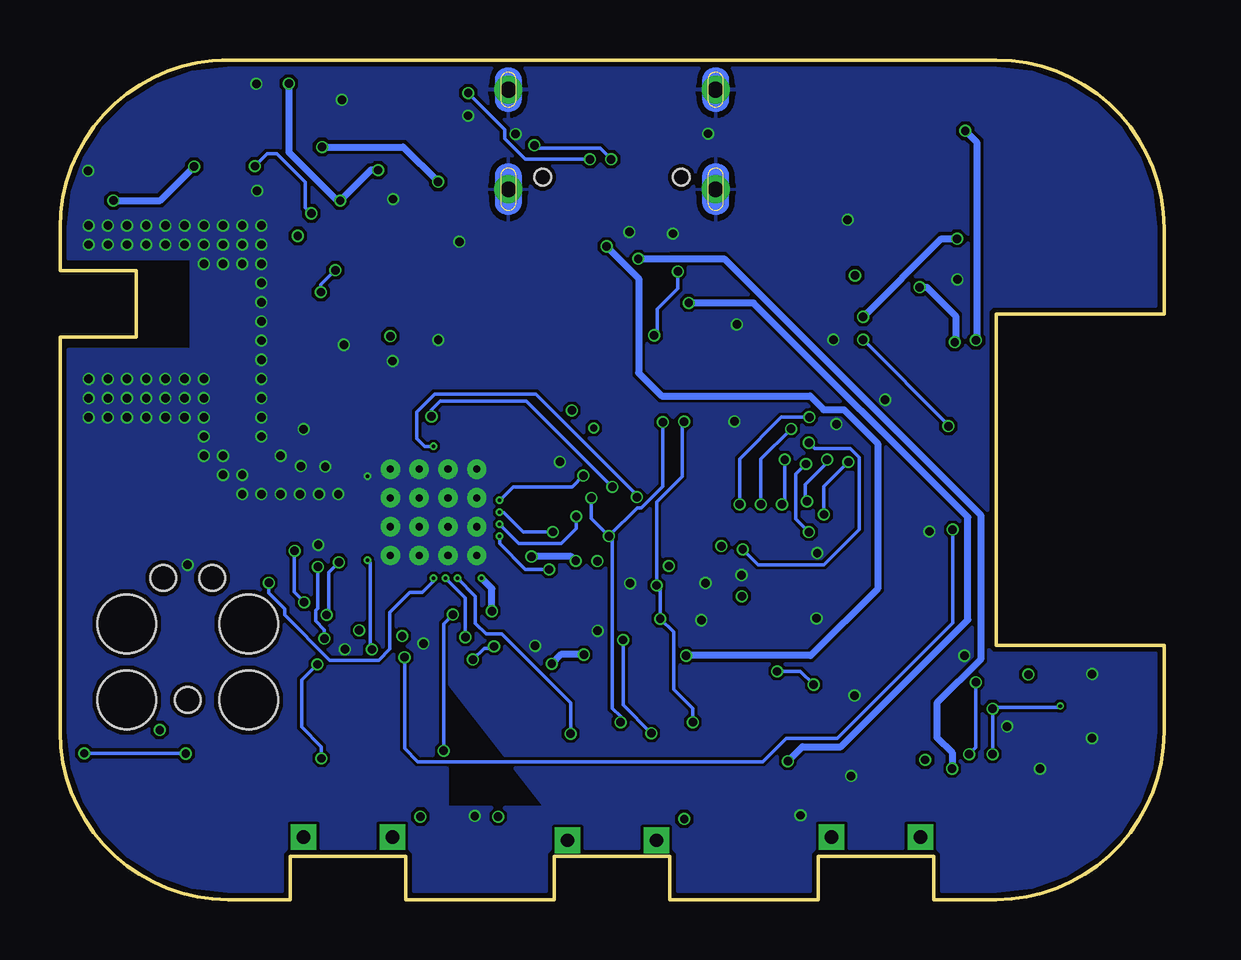
[diagram p4: board, bottom side, seen from below]

Size 46 x 35 mm. Coordinates in mm from the lower left corner, seen from the top.
Outline: 39,35 7,35 arc90 0,28 0,24.4 7,24.4 7,10.6 0,10.6 0,7 arc90 7,0 9.6,0 9.6,1.8 14.4,1.8 14.4,0 20.6,0 20.6,1.8 25.4,1.8 25.4,0 31.6,0 31.6,1.8 36.4,1.8 36.4,0 39,0 arc90 46,7 46,23.45 42.82,23.45 42.82,26.21 46,26.21 46,28 arc90 39,35
Outline: 39.25,35 39,35
Copper layers (1+2*63+16): Top / GND / Bottom / layer 63
Stack-up 4 Layer Stack: Top SilkScreen Epoxy Ink / Top SolderMask User Defined 0.02mm Dk 4.3 / Top Surface Finish Lead-Free 0.02mm / Top User Defined 0.03mm / Dielectric-1 User Defined 0.034mm / Dielectric-2 User Defined 0.034mm / GND User Defined 0.03mm / Dielectric-3 User Defined 0.664mm / Power User Defined 0.03mm / Dielectric-4 User Defined 0.034mm / Dielectric-5 User Defined 0.034mm / Bottom User Defined 0.03mm / Bottom Surface Finish Lead-Free 0.02mm / Bottom SolderMask User Defined 0.02mm Dk 4.3 / Bottom SilkScreen Epoxy Ink
Design rules: minimum copper width 5mil, minimum drill size 0.3mm, copper clearance wire_polygon to wire_polygon 5mil, copper clearance wire_polygon to pad_smd 5mil, copper clearance wire_polygon to via 5mil, copper clearance pad_smd to pad_smd 5mil, copper clearance pad_smd to via 5mil, copper clearance via to via 5mil, copper clearance smd to pad (same net) 5mil, copper clearance smd to via (same net) 5mil, copper clearance smd to smd (same net) 5mil, dimension clearance 0.2mm, via restrict clearance 0mil, restrict clearance 0mil, drill distance 6mil, keepout clearance 0mil

### Footprints (pad centres in the part's own frame; a part is rotated, then mirrored left to right if it is on the bottom)
2450AT18B100E_ANTC3216X140N = smd 1.15 x 1.8: 1 -1.5,0; 2 1.5,0
NORDIC_NRF_3_RESC0201_L = smd 0.28 x 0.43: 1 -0.255,0; 2 0.255,0
NORDIC_NRF_3_RESC0402_L = smd 0.5 x 0.6: 1 -0.5,0; 2 0.5,0
GRM011R60J152KE01L_1_0201 = smd 0.35 x 0.25: 1 0,0.275; 2 0,-0.275
ESP32_C6_LIBRARY_5_SOD3716X135N = smd 1.15 x 0.8: 1 -1.75,0; 2 1.75,0
ESP32_C6_LIBRARY_3_SOT95P280X145-6N = smd 1.2 x 0.6: 1 -1.25,0.95; 2 -1.25,0; 3 -1.25,-0.95; 4 1.25,-0.95; 5 1.25,0; 6 1.25,0.95
BQ25180YBGR_BGA8C40P2X4_100X155X50 = smd 0.2 x 0.2: A1 -0.2,0.6; A2 0.2,0.6; B1 -0.2,0.2; B2 0.2,0.2; C1 -0.2,-0.2; C2 0.2,-0.2; D1 -0.2,-0.6; D2 0.2,-0.6
DRV2605YZFR_BGA9C50P3X3_144X144X62 = smd 0.25 x 0.25: A1 -0.5,0.5; A2 0,0.5; A3 0.5,0.5; B1 -0.5,0; B2 0,0; B3 0.5,0; C1 -0.5,-0.5; C2 0,-0.5; C3 0.5,-0.5
BMA423_BMA423 = smd 0.3 x 0.35: 1 -0.75,-0.775; 2 -0.25,-0.775; 3 0.25,-0.775; 4 0.75,-0.775; 7 0.75,0.775; 8 0.25,0.775; 9 -0.25,0.775; 10 -0.75,0.775 | smd 0.35 x 0.3: 5 0.775,-0.25; 6 0.775,0.25; 11 -0.775,0.25; 12 -0.775,-0.25
RT6160AWSC_BGA15C40P3X5_140X230X60 = smd 0.216 x 0.216: A1 -0.4,0.8; A2 0,0.8; A3 0.4,0.8; B1 -0.4,0.4; B2 0,0.4; B3 0.4,0.4; C1 -0.4,0; C2 0,0; C3 0.4,0; D1 -0.4,-0.4; D2 0,-0.4; D3 0.4,-0.4; E1 -0.4,-0.8; E2 0,-0.8; E3 0.4,-0.8
503480-2400_5034802400 = smd 0.3 x 0.7: 1 -5.75,1.525; 2 -5.25,1.525; 3 -4.75,1.525; 4 -4.25,1.525; 5 -3.75,1.525; 6 -3.25,1.525; 7 -2.75,1.525; 8 -2.25,1.525; 9 -1.75,1.525; 10 -1.25,1.525; 11 -0.75,1.525; 12 -0.25,1.525; 13 0.25,1.525; 14 0.75,1.525; 15 1.25,1.525; 16 1.75,1.525; 17 2.25,1.525; 18 2.75,1.525; 19 3.25,1.525; 20 3.75,1.525; 21 4.25,1.525; 22 4.75,1.525; 23 5.25,1.525; 24 5.75,1.525 | smd 0.3 x 1: MP1 -6.54,-1.125; MP2 6.54,-1.125
TC2030-IDC_TC2030IDC = smd 0.783 x 0.783: 1 -0.953,-0.635; 2 -0.953,0.635; 3 0.317,-0.635; 4 0.317,0.635; 5 1.588,-0.635; 6 1.588,0.635 | hole 2.451: -2.223,-2.54; -2.223,2.54; 0.952,-2.54; 0.952,2.54 | hole 1.067: -2.223,0; 2.857,-1.016; 2.857,1.016
KH-TYPE-C-16P_KINGHELM_KH-TYPE-C-16P = smd 0.6 x 1.15: A1_B12 -3.2,4.725; A4_B9 -2.4,4.725; A9_B4 2.4,4.725; A12_B1 3.2,4.725 | smd 0.3 x 1.15: A5 -1.25,4.725; A6 -0.25,4.725; A7 0.25,4.725; A8 1.25,4.725; B5 1.75,4.725; B6 0.75,4.725; B7 -0.75,4.725; B8 -1.75,4.725 | drill 0.65 pad 1.05: SH1 -4.32,0; SH2 4.32,0; SH3 -4.32,4.15; SH4 4.32,4.15 | hole 0.7: -2.89,3.65; 2.89,3.65
NORDIC_NRF_2_RESC0402_L = smd 0.5 x 0.6: 1 -0.5,0; 2 0.5,0
ESP32_C6_LIBRARY_2_IND_4828-WE-TPC_WRE = smd 0.9 x 5.3: 1 -2.286,0; 2 2.286,0
MLP2016SR47MT0S1_INDC2016X100N = smd 1.2 x 2.2: 1 -1.028,0; 2 1.028,0
ESP32_C6_LIBRARY_4_ESP32_C6_LIBRARY_4_ESP32_C6_LIBRARY_4_ESP32_C6_LIBRARY_4_ESP32_WROVER_SPARKFUN-DISCRETESEMI_SOT23-3 = smd 0.8 x 0.9: 1 -0.95,-1; 2 0.95,-1; 3 0,1.1
ESP32_C6_LIBRARY_6_SOT65P210X110-3N = smd 1.05 x 0.5: 1 -1.05,0.65; 2 -1.05,-0.65; 3 1.05,0
CPF0201D7K68C1_0201 = smd 0.35 x 0.25: 1 0,0.275; 2 0,-0.275
ESP32_C6_LIBRARY_7_JUMPER_SJ = smd 1.168 x 1.6: 1 -0.762,0; 2 0.762,0
2025-10-22_07-23-44_LIBRARY_SW_EVP-AKE31A_PAN = smd 0.711 x 1.092: 1 -1.4,-0.972; 2 1.4,-0.972 | drill 0.559 pad 0.914 square: 3 -1.848,0.381; 4 1.848,0.381 | smd 1.397 x 1.092: 5 0,-1.124
HECTOR_WATCH_1_TP20R = smd 2 x 2: TP 0,0
NORDIC_NRF_4_AQFN50P700X700X85_HS-74N = smd 4.85 x 4.85: P$74 0,0 | drill 0.3 pad 0.6: P$75 -1.8,1.8; P$76 -0.6,1.8; P$77 0.6,1.8; P$78 1.8,1.8; P$79 -1.8,0.6; P$80 -0.6,0.6; P$81 0.6,0.6; P$82 1.8,0.6; P$83 -1.8,-0.6; P$84 -0.6,-0.6; P$85 0.6,-0.6; P$86 1.8,-0.6; P$87 -1.8,-1.8; P$88 -0.6,-1.8; P$89 0.6,-1.8; P$90 1.8,-1.8 | smd 0.2 x 0.2: P$A8 -1.25,3.25; P$A10 -0.75,3.25; P$A12 -0.25,3.25; P$A14 0.25,3.25; P$A16 0.75,3.25; P$A18 1.25,3.25; P$A20 1.75,3.25; P$A22 2.25,3.25; P$A23 2.75,3.25; P$AA24 3.25,-2.25; P$AB2 -2.75,-2.5; P$AC5 -2,-2.75; P$AC9 -1,-2.75; P$AC11 -0.5,-2.75; P$AC13 0,-2.75; P$AC15 0.5,-2.75; P$AC17 1,-2.75; P$AC19 1.5,-2.75; P$AC21 2,-2.75; P$AC24 3.25,-2.75; P$AD2 -2.75,-3.25; P$AD4 -2.25,-3.25; P$AD6 -1.75,-3.25; P$AD8 -1.25,-3.25; P$AD10 -0.75,-3.25; P$AD12 -0.25,-3.25; P$AD14 0.25,-3.25; P$AD16 0.75,-3.25; P$AD18 1.25,-3.25; P$AD20 1.75,-3.25; P$AD22 2.25,-3.25; P$AD23 2.75,-3.25; P$B1 -3.25,2.75; P$B3 -2.5,2.75; P$B5 -2,2.75; P$B7 -1.5,2.75; P$B9 -1,2.75; P$B11 -0.5,2.75; P$B13 0,2.75; P$B15 0.5,2.75; P$B17 1,2.75; P$B19 1.5,2.75; P$B24 3.25,2.75; P$C1 -3.25,2.25; P$D2 -2.75,2; P$D23 2.75,2; P$E24 3.25,1.75; P$F2 -2.75,1.5; P$F23 2.75,1.5; P$G1 -3.25,1.25; P$H2 -2.75,1; P$H23 2.75,1; P$J1 -3.25,0.75; P$J24 3.25,0.75; P$K2 -2.75,0.5; P$L1 -3.25,0.25; P$L24 3.25,0.25; P$M2 -2.75,0; P$N1 -3.25,-0.25; P$N24 3.25,-0.25; P$P2 -2.75,-0.5; P$P23 2.75,-0.5; P$R1 -3.25,-0.75; P$R24 3.25,-0.75; P$T2 -2.75,-1; P$T23 2.75,-1; P$U1 -3.25,-1.25; P$U24 3.25,-1.25; P$V23 2.75,-1.5; P$W1 -3.25,-1.75; P$W24 3.25,-1.75; P$Y2 -2.75,-2; P$Y23 2.75,-2
ESP32_C6_LIBRARY_SON50P200X200X80-9N = smd 0.76 x 0.27: 1 -0.985,0.75; 2 -0.985,0.25; 3 -0.985,-0.25; 4 -0.985,-0.75; 5 0.985,-0.75; 6 0.985,-0.25; 7 0.985,0.25; 8 0.985,0.75 | smd 0.9 x 1.3: 9 0,0
NORDIC_NRF_BT-XTAL_2016_N = smd 0.95 x 0.85: 1 -0.725,-0.575; 2 0.725,-0.575; 3 0.725,0.575; 4 -0.725,0.575
NORDIC_NRF_1_XTAL_3215_N = smd 1 x 1.8: 1 -1.25,0; 2 1.25,0

### Placement (x,y rotation side)
ANT1  43.37,24.83 0 top
C1  33.08,20.75 90 top
C1-EP-DR  4.62,25.85 180 top
C2  33.09,22.12 270 top
C2-EP-DR  6.08,33.7 90 top
C3  38.64,24.76 90 top
C4  39.39,24.76 90 top
C5  26.18,18.27 180 top
C6  24.12,12.55 270 top
C7  31,12.01 270 top
C8  32.7,11.76 270 top
C9  34.56,15.57 0 top
C10  29.72,21.08 270 top
C11  34.83,19.62 0 top
C12  32.03,20.3 90 top
C13  31.04,23.19 90 top
C14  24.99,19.29 180 top
C15  28.88,21 270 top
C16  30.35,22 0 top
C17  26.25,20.68 0 top
C18  23.77,20.63 180 top
C19  18.65,10.79 0 top
C20  27.11,11.42 270 top
C21  26.11,12.28 270 top
C22  40.15,24.76 90 top
C23  31.95,30.17 180 top
C24  31.19,29.82 90 top
C25  42.27,29.21 0 top
C27  18.87,23.95 90 top
C29  11.99,5.13 270 top
C30  34,5.13 270 top
C31  23,5.13 270 top
C32  4.26,5.74 180 top
C33  43.83,30.48 90 top
C34  4.05,10.15 90 top
C37  18.88,24.55 90 top
C38  29.66,28.34 180 top
C39  32.13,27.76 90 top
C42  29.07,28.34 0 top
C43  28.87,29.9 90 top
D2  10.03,33.2 180 top
D3  31.62,32.67 0 top
D4  15.25,33.21 180 top
D5  10.04,29.8 180 top
EPD_C1  13.13,21.1 180 top
EPD_C2  13.13,22.09 180 top
EPD_C5  12.77,16.44 180 top
EPD_C6  13,15.28 180 top
EPD_C7  13,13.89 180 top
EPD_C8  13,12.48 180 top
EPD_C9  13,11.09 180 top
EPD_C10  13,9.74 180 top
EPD_C11  9.21,9.06 0 top
EPD_C12  11.19,9.06 180 top
IC1  35.37,32.66 180 top
IC2  4.32,8.07 180 top
IC3  19.11,13.21 90 top
IC9  39.13,32.26 0 top
J1  9.1,17.51 270 top
J2  40.68,10.54 90 top
J4  23,33.76 180 top
L1  39.19,23.7 0 top
L2  27.45,21.93 90 top
L3  28.82,22.37 0 top
L5  4.67,29.73 270 top
L7  42.16,31.56 270 top
Q1  13.78,26.06 180 top
Q3  14.52,30.1 180 top
R1_EP_DR  16.69,30.97 180 top
R1_USB1  24.32,27.57 180 top
R2  37.01,28.89 90 top
R2_EP_DR  14.15,28.35 90 top
R2_USB  21.27,27.55 0 top
R3  22.2,12.48 270 top
R4  35.58,30.29 0 top
R5  31.27,4.3 270 top
R7  10.21,5.06 270 top
R8  20.23,4.18 270 top
R9  37.07,30.27 180 top
R17  36.17,30.3 180 top
R18  36.46,29.47 90 top
R_PWR_EPD  14.85,24.97 270 top
R_TYPE_SEL  17.32,30.42 180 top
SJ1  17.24,27.07 180 top
SW_DN  12,2.99 180 top
SW_ENT  23,2.85 180 top
SW_UP  34,2.99 180 top
TP_3.3V  26.97,2.01 0 top
TP_3V3  43.51,4.35 0 top
TP_BAT_GND  16.09,2 0 top
TP_GND  29.64,2.11 0 top
TP_ON  1.33,8.87 0 top
TP_OP  1.31,6.53 0 top
TP_RESET  40.71,4.34 0 top
TP_SCL  2.92,3.67 0 top
TP_SDA  5.38,3.72 0 top
TP_SWDCLK  34.21,8.61 0 top
TP_SWDIO  37.88,4.35 0 top
TP_SWO  31.59,8.59 0 top
TP_VBAT  18.71,2 0 top
TP_VREG  8.04,3.72 0 top
U1  30.44,16.14 0 top
U3  19.37,21.98 270 top
X1  35.17,21.36 0 top
X2  24.9,22.25 180 top

### Tracks (layer width: path | path; a pad name or v marks a point on that pad's centre or on a via)
3V3  (via drill 0.35)
  Top 0.3: Q1.2 12.83,26.06 v12.88,26.02 13.96,26.02 14.46,25.52 14.46,25.09 R_PWR_EPD.2 | U1.P$Y2 27.44,14.39 U1.P$W1 26.45,14.39 v26.35,14.3 | U1.P$B1 25.89,18.89 C14.1 25.49,20.15 25.21,20.43 24.71,20.43 v24.67,20.39 | U1.P$AD23 33.19,12.51 C8.1 32.94,12.02 33.19,11.76 33.19,11.57 v33.54,11.22 | U1.P$A22 32.56,19.52 32.56,19.55 32.34,19.77 32.3,19.77 C12.1 31.93,20.13 31.7,20.13 31.54,20.3 31.54,22.79 v32.23,23.49 | IC3.3 20.18,13.46 v20.63,13.91 | v18.44,14.74 18.33,14.63 IC3.7 | C19.1 18.39,12.4 IC3.10 17.78,12.46 v17.6,12.64 v17.59,12.64 | R17.1 36.18,30.01 R18.1 36.18,27.76 v36.09,27.67 | IC9.E3 40.41,30.57 | 40.41,30.57 v40.41,30.56 40.41,29.6 40.8,29.21 C25.1 | IC9.E2 39.13,31.15 39.8,30.47 40.31,30.47 40.41,30.57 | C33.1 43.83,29.2 v43.77,29.14 | J2.1 41.31,8.93 41.56,8.69 41.56,7.35 v41.84,7.07 43.51,5.4 TP_3V3.TP | R8.2 19.96,3.39 v19.99,3.36 | R5.2 v31,3.47 v30.98,3.46 | v5.65,9.38 5.65,9.66 5.16,10.15 C34.2 4.25,10.08 4.25,8.58 4.26,8.57 IC2.C2 | v24.51,14.12 24.11,13.72 C6.1 23.61,13.56 v23.61,14.11 | TP_3.3V.TP 26.97,2.69 v27.74,3.46 | U1.P$AD14 30.73,12.85 30.73,12.54 C7.1 31.1,12.17 31.33,12.17 31.5,12.01 31.5,11.23 v31.74,10.98 | R7.2 9.94,5.8 v9.96,5.82
  Bottom 0.3: v43.77,29.14 41.83,29.14 v40.41,30.56 | v24.51,14.12 24.69,14.3 v26.35,14.3
  pour Power: -1.1,35.8 46.9,35.8 46.9,-0.8 -0.9,-1.2
ALERT  (via drill 0.35)
  Top 0.15: U1.P$J24 33.69,16.82 34.53,15.98 35.03,15.98 36.22,14.8 v36.22,14.54 | v14.6,8.96 14.72,8.96 15.71,7.97 29.46,7.97 30.96,6.47 35.09,6.47 35.73,7.11 35.73,12.29 v35.83,12.39 | v15.92,16.48 15.82,16.38 15.82,10.39 16.12,10.08 v16.12,9.51 | v15.8,18.34 15.8,19.11 17.69,21 U3.5
  Bottom 0.15: v15.92,16.48 15.8,16.59 v15.8,18.34 | v16.12,9.51 15.15,9.51 v14.6,8.96 | v36.22,14.54 36.24,14.52 36.24,12.82 35.83,12.41 v35.83,12.39
D+  (via drill 0.35)
  Top 0.15: v17.68,16.48 16.37,15.16 16.37,10.87 17.89,9.35 26.72,9.35 v27.91,10.55 v27.92,10.55 | v28.79,10 28.65,10.14 28.65,11.21 28.89,11.45 28.89,12.58 28.69,12.79 U1.P$AD6 | D3.4 33.29,31.3 33.29,29.74 33.17,29.62 33.17,27.27 32.01,26.11 21.49,26.11 20.98,25.6 16.93,25.6 14.63,23.3 14.63,20.51 14.78,20.36 v14.78,20.11
  Bottom 0.15: v28.79,10 28.33,10.47 28,10.47 v27.92,10.55 | v17.68,16.48 17.68,18.37 15.94,20.11 v14.78,20.11
D-  (via drill 0.35)
  Top 0.15: D3.6 33.31,33.18 33.55,33.18 33.67,33.06 33.67,31.34 33.57,31.24 33.57,29.63 33.44,29.5 33.44,27.16 32.12,25.84 21.6,25.84 21.09,25.33 17.05,25.33 14.91,23.18 14.91,21.11 15.36,20.66 15.36,19.8 v15.53,19.62 | v16.8,16.48 16.09,15.77 16.09,10.73 16.29,10.54 16.31,10.54 17.77,9.08 27.08,9.08 28.37,10.36 28.37,11.32 28.62,11.56 28.62,12.46 U1.P$AD4
  Bottom 0.15: v15.53,19.62 16.8,18.36 v16.8,16.48
DN  (via drill 0.35)
  Top 0.15: J4.A7 22.9,29.18 22.9,29.7 23.02,29.81 23.48,29.81 23.6,29.7 23.6,29.18 J4.B7 23.75,30.69 v23.92,30.86 | v28.99,33.62 D3.1
  Bottom 0.15: v28.99,33.62 27.47,32.1 27.47,31.72 26.61,30.86 v23.92,30.86
DP  (via drill 0.35)
  Top 0.15: J4.A6 23.1,28.89 23.1,28.38 22.98,28.26 22.52,28.26 22.4,28.38 22.4,28.89 J4.B6 22.25,29.99 23.04,30.77 v23.04,30.86 | v26.23,31.44 30.08,31.44 D3.3
  Bottom 0.15: v23.04,30.86 23.49,31.32 26.11,31.32 v26.23,31.44
EPD_3V3  (via drill 0.35)
  Top 0.3: J1.16 J1.15 | J1.15 10.55,16.33 10.16,16.33 9.57,16.92 9.57,25.77 8.81,26.53 4.86,26.53 4.18,25.85 C1-EP-DR.2 4.12,26.9 L5.2 4.77,27.55 v8.62,27.55 | Q1.3 13.12,24.29 v12.53,24.29 | J1.15 11.89,16.26 12.07,16.44 EPD_C5.2
  Bottom 0.3: v12.53,24.29 9.28,27.55 v8.62,27.55
EPD_BUSY  (via drill 0.35)
  Top 0.15: J1.9 13.88,19.26 14.92,18.22 v14.92,18.16 | v14.79,15.32 14.99,15.12 14.99,9.22 15.96,8.25 28.72,8.25 30.38,9.9 30.38,12.7 U1.P$AD12
  Bottom 0.15: v14.79,15.32 15.34,15.86 15.34,17.74 v14.92,18.16
EPD_CS  (via drill 0.15, 0.35)
  Top 0.15: J1.12 14.67,17.76 14.73,17.7 24.16,17.7 v24.19,17.67
  Bottom 0.15: U1.P$K2 27.12,17.21 24.66,17.21 v24.19,17.67
  other vias: 27.69,16.64
EPD_DC  (via drill 0.35)
  Top 0.15: J1.11 13.13,18.26 v13.15,18.24 | v14.17,16.05 14.45,15.77 14.98,15.77 15.26,15.49 15.26,9.34 16.08,8.52 28.6,8.52 30.1,10.02 30.1,12.37 29.69,12.79 U1.P$AD10
  Bottom 0.15: v13.15,18.24 14.17,17.22 v14.17,16.05
EPD_RST  (via drill 0.15, 0.35)
  Top 0.15: J1.10 13.49,18.76 13.91,18.34 v14.03,18.34 | v29.11,10.94 29.37,10.67 29.37,9.68 28.49,8.8 16.19,8.8 15.54,9.45 15.54,15.94 v14.88,16.6
  Bottom 0.15: v29.11,10.94 29.11,12.56 U1.P$AC11 | v14.03,18.34 14.03,18.21 14.95,17.3 14.95,16.68 v14.88,16.6
  other vias: 29.94,13.39
GDR
  Top 0.3: J1.2 10.7,22.83 11.09,22.83 11.32,23.06 11.32,26.79 12.34,27.81 14.15,27.81 14.43,28.09 R2_EP_DR.2 14.43,28.55 15.32,29.45 Q3.1
GND  (via drill 0.15, 0.35)
  Top 0.3: J4.A12_B1 19.25,29.04 J4.SH4 | U1.P$B7 29.06,18.77 29.06,18.74 29.84,17.96 U1.P$76 | J4.A1_B12 26.77,29.61 J4.SH3 | C18.1 24.32,20.92 25.48,20.92 25.71,20.68 C17.1 | IC9.C1 IC9.C2 IC9.C3 | v40.68,13.96 40.81,13.82 40.81,13.03 41.31,12.53 J2.5 J2.3 | U1.P$74 31.94,17.64 U1.P$F23
  other vias: 8.32,10.17 14.45,14.44 14.48,11.73 12.9,8.5 13.65,19.82 8.61,25.85 13.19,28.34 19,31.93 27.01,31.91 25.17,18.24 35.85,19.61 30.24,23.33 17.79,23.97 19.1,13.19 17.6,13.53 22.24,13.18 19.27,11.65 17.9,19.93 20.46,27.76 29,32.68 34.26,33.34 37.82,34.01 37.79,29.55 44.83,30.38 32.12,29.2 29.36,27.42 3,9.4 5.17,5.45 26.2,10.58 3,6.72 23.6,11.2 35.24,14.78 6.54,7.22 33.19,17.64 34.17,23.13 32.14,22.45 30.86,10.67 28.72,3.48 13.04,5.15 22.28,27.83 9.78,15.34 34.13,10.43 13.78,23.34 11.62,20.83 34.95,18.04 35.96,18.07 15.15,3.51 44.81,28.1 44.01,28.1 43.21,28.1 42.41,28.1 41.61,28.1 40.81,28.1 40.01,28.1 39.21,28.1 38.41,28.1 37.61,28.1 44.81,27.3 44.01,27.3 43.21,27.3 42.41,27.3 41.61,27.3 40.81,27.3 40.01,27.3 39.21,27.3 38.41,27.3 37.61,27.3 40.01,26.5 39.21,26.5 38.41,16.9 37.61,16.9 36.81,16.9 36.01,16.9 35.21,16.9 34.41,16.9 38.41,17.7 39.21,17.7 36.81,18.5 39.21,18.5 40.01,18.5 37.61,19.3 40.01,19.3 37.61,20.1 40.01,20.1 40.81,20.1 41.61,20.1 42.41,20.1 43.21,20.1 44.01,20.1 44.81,20.1 37.61,20.9 40.01,20.9 40.81,20.9 41.61,20.9 42.41,20.9 43.21,20.9 44.01,20.9 44.81,20.9 37.61,21.7 40.01,21.7 40.81,21.7 41.61,21.7 42.41,21.7 43.21,21.7 44.01,21.7 44.81,21.7 37.61,22.5 37.61,23.3 37.61,24.1 37.61,24.9 37.61,25.7 37.61,26.5 38.41,26.5
  pour Top: -1,37.6 43.1,37.6 47.1,33.6 47.1,2.4 41.8,-2.9 1.2,-2.9 -1,-0.7
  pour Bottom: -2.8,-3.3 -2.8,36 -1,37.8 43.1,37.8 47,33.6 47,-0.9 44.6,-3.3
  pour GND: -0.1,27.9 -0.1,-0.4 46,-0.4 46,28 arc90 39,35 7,35 arc90
HAPTIC_EN  (via drill 0.35)
  Top 0.15: IC2.A1 5.73,6.66 19.93,6.66 20.21,6.93 v21.36,6.93 | U1.P$U1 26.11,14.89 24.86,13.64 24.86,11.2 24.35,10.69 22.67,10.69 v22.54,10.82
  Bottom 0.15: v21.36,6.93 22.54,8.11 v22.54,10.82
IMU_INT1
  Top 0.15: U1.P$N1 25.22,15.89 24.84,15.52 24.12,15.52 24.04,15.6 20.01,15.6 19.21,14.81 19.21,14.13 IC3.5
IMU_INT2  (via drill 0.15, 0.35)
  Top 0.15: IC3.6 18.9,14.02 18.9,15.05 19.82,15.97 v24.49,15.97
  Bottom 0.15: v24.49,15.97 24.49,15.46 25.11,14.84 26.88,14.84 U1.P$P2
  other vias: 27.69,15.64
LX1
  Top 0.15: IC9.B2 IC9.B3 40.15,32.66 40.15,32.65
  Top 0.3: 40.15,32.65 40.21,32.59 L7.1
LX2
  Top 0.15: IC9.D2 IC9.D3 40.06,31.87
  Top 0.3: L7.2 40.98,31.71 40.95,31.71 40.79,31.87 40.06,31.87
MOSI  (via drill 0.15, 0.35)
  Top 0.15: v21.96,16.78 21.68,17.06 12.32,17.06 12.06,16.8 11.93,16.8 11.89,16.76 J1.14
  Bottom 0.15: v21.96,16.78 21.96,16.86 26.17,21.07 30.39,21.07 31.14,20.32 31.14,19.23 30.8,18.89 U1.P$B13
  other vias: 30.44,18.89
N$1
  Top 0.3: C9.1 34.05,15.57 33.84,15.77 33.81,15.77 U1.P$N24
N$2
  Top 0.3: C3.1 38.64,23.74 L1.1 38.69,18.84 37.3,17.46 33.66,17.46 33.35,17.14 U1.P$H23
N$3
  Top 0.3: U1.P$A18 31.56,19.52 31.56,19.66 31.1,20.13 31.1,22.87 C13.1
N$4
  Top 0.3: U1.P$B3 27.89,18.94 27.89,19.95 27.88,19.96 27.88,21 L2.1
N$5
  Top 0.3: IC2.A2 4.25,7.5 4.25,6.03 C32.2
N$6
  Top 0.3: IC1.D1 35.93,33.26 37.07,32.12 R9.2
N$7
  Top 0.3: U1.P$D23 33.51,18.47 33.86,18.47 34.19,18.79 34.19,19.23 C11.1
N$8
  Top 0.3: C1.1 34.16,20.5 X1.1 34.45,20.35 33.69,19.59 U1.P$B24
N$9
  Top 0.3: X1.3 34.96,22.87 34.96,23.39 34.62,23.74 33.45,23.74 32.81,23.1 32.81,22.66 C2.1 32.85,22.38 32.58,22.11 32.58,20.15 33.19,19.55 U1.P$A23
N$10
  Top 0.3: ANT1.1 41.55,24.5 C22.1 C4.1 39.39,23.99 L1.2
N$11
  Top 0.3: U1.P$E24 33.82,18.03 34.03,18.03 34.8,18.8 35.8,18.8 37.03,20.03 37.03,22.96 35.82,24.17 30.32,24.17 29.71,23.56 29.71,23.11 30.1,22.73 C16.1 29.73,22.37 L3.2 29.32,21.95 C15.1 | U1.P$B5 28.37,18.96 28.37,20.08 28.3,20.14 28.3,21.24 28.57,21.5 C15.1 | C15.1 29.55,21.5 C10.1
N$12
  Top 0.3: L2.2 28.27,22.43 L3.1
N$13
  Top 0.3: U1.P$C1 26.56,18.39 C5.1
N$14
  Top 0.15: 27.43,19.33 27.54,19.22 27.54,18.29 U1.P$D2
  Top 0.3: X2.1 26.15,21.43 26.61,20.98 26.61,20.79 C17.2 26.62,20.68 27.15,20.16 27.15,19.62 27.43,19.33
N$15
  Top 0.3: U1.P$F2 27.47,17.64 27.34,17.77 26.94,17.77 26.74,17.57 25.08,17.57 23.18,19.48 23.18,20.29 C18.2 23.52,22.11 X2.2
N$16  (via drill 0.3)
  other vias: 23.76,19.66
N$17  (via drill 0.15, 0.35)
  Top 0.3: C20.1 27.9,11.92 v28,12.02
  Bottom 0.3: v28,12.02 28,12.96 U1.P$AC5
  other vias: 28.44,13.39
N$18
  Top 0.15: IC9.E1 38.73,29.81 37.8,28.89 R2.2
N$19  (via drill 0.35)
  Top 0.15: IC9.D1 38.64,31.77 38.6,31.77 37.88,31.05 v37.88,30.57 | v35.53,28.61 35.58,28.66 R4.2
  Bottom 0.15: v37.88,30.57 37.37,31.08 36.96,31.08 35.77,29.9 35.77,28.85 v35.53,28.61
N$20
  Top 0.3: J4.B5 21.27,29.02 R2_USB.1
N$21
  Top 0.3: IC3.1 19.9,12.48 R3.2
N$22
  Top 0.3: J4.A5 24.32,28.96 24.32,28.35 | 24.32,28.35 R1_USB1.2 | 24.32,28.35
N$23
  Top 0.3: J1.4 10.7,21.83 11.09,21.83 11.35,22.09 EPD_C2.2
N$24
  Top 0.3: J1.18 10.7,14.83 11.09,14.83 11.54,15.28 EPD_C6.2
N$25
  Top 0.3: J1.5 11.02,21.26 11.12,21.36 12.37,21.36 EPD_C1.2
N$26
  Top 0.3: J1.19 12.12,14.26 EPD_C7.2
N$27
  Top 0.3: EPD_C8.2 12.26,12.73 11.23,13.76 J1.20
N$29
  Top 0.3: J1.22 10.7,12.69 11.09,12.69 11.4,12.38 11.4,10.09 11.75,9.74 EPD_C10.2
N$31
  Top 0.3: J1.24 10.8,11.59 10.8,9.17 EPD_C12.2
N$32
  Top 0.3: C2-EP-DR.1 6.08,32.95 5.15,32.02 L5.1 6.07,32.02 D5.2 8.29,30.6 8.65,30.95 12.62,30.95 Q3.3
N$33
  Top 0.3: R_TYPE_SEL.2 R1_EP_DR.1 16.84,30.54 16.84,27.43 SJ1.2
N$34
  Top 0.3: D4.2 D2.1 11.79,34.01 11.33,34.46 6.35,34.46 C2-EP-DR.2
OUT+
  Top 0.3: IC2.A3 3.82,6.73 3.16,6.07 1.78,6.07 TP_OP.TP
OUT-
  Top 0.3: TP_ON.TP 1.63,8.57 IC2.C3
P0.13  (via drill 0.35)
  Top 0.15: R5.1 31.32,4.52 31.32,4.89 v30.02,6.2 | v29.63,11.88 29.63,12.45 U1.P$AD8
  Top 0.3: R5.1 32.26,4.3 SW_UP.2 32.6,4.35 33.19,4.94 33.53,4.94 C30.2
  Bottom 0.15: v29.63,11.88 30.02,11.5 v30.02,6.2
P0.14  (via drill 0.15, 0.35)
  Top 0.15: C31.2 22.94,5.35 22.94,5.39 24.47,6.91 v24.73,6.91
  Top 0.3: C31.2 22.39,4.8 22.19,4.8 21.6,4.21 SW_ENT.2 21.24,4.18 R8.1
  Bottom 0.15: v24.73,6.91 24.73,8.2 27.6,11.07 28.25,11.07 28.69,11.52 28.69,12.65 U1.P$AC9
  other vias: 29.44,13.39
P1.01  (via drill 0.15, 0.35)
  Top 0.15: R_PWR_EPD.1 14.9,24.75 14.9,24.71 13.98,23.79 13.59,23.79 13.14,23.34 v12.54,23.34 | v8.99,19.73 8.99,15.6 v8.81,15.42 | v31.64,10.1 31.34,9.8 31.09,9.8 30.39,9.09 30.39,7.43 31.02,6.8 32.34,6.8 32.79,7.25 32.79,10.22 v33,10.43
  Top 0.3: Q1.1 14.73,26.48 15.12,26.09 R_PWR_EPD.1
  Bottom 0.15: v12.54,23.34 8.99,19.79 v8.99,19.73 | v31.64,10.1 31.64,6.3 31.09,5.75 16.72,5.75 15.75,6.72 13.61,6.72 8.81,11.53 v8.81,15.42 | v33,10.43 33.07,10.49 33.07,14.03 U1.P$Y23
  other vias: 33.19,14.14
P1.02  (via drill 0.35)
  Top 0.15: C29.2 11.94,5.35 11.94,5.39 12.93,6.38 22.27,6.38 23.24,7.35 24.52,7.35 24.87,7.69 29.35,7.69 30.85,6.19 34.81,6.19 v35.11,5.89 | v34.38,14.06 34.05,14.39 U1.P$W24 | v34.9,11.86 34.9,11.64 35.44,11.1 35.44,9.85 35.39,9.8 v35.28,9.8
  Top 0.3: C29.2 11.52,4.94 11.19,4.94 10.6,4.35 SW_DN.2 10.6,4.95 R7.1
  Bottom 0.15: v35.28,9.8 35.93,9.15 35.93,7.19 35.11,6.37 v35.11,5.89 | v34.38,14.06 34.8,13.64 34.8,11.96 v34.9,11.86
PMIC_INT  (via drill 0.15, 0.35)
  Top 0.15: v17.55,14.6 16.67,13.72 16.67,10.96 18,9.63 24.35,9.63 25.14,10.42 25.14,13.28 v25.62,13.76 | IC1.A1 35.95,31.68 35.95,31.58 34.8,30.43 34.8,27.52 32.41,25.13 22.24,25.13 21.25,24.14 v21.25,23.52 | v14.8,19.04 14.8,19.44 14.32,19.92 14.32,23.4 16.8,25.88 19.95,25.88 v20.26,26.18
  Bottom 0.15: v17.55,14.6 16.91,13.96 14.18,13.96 12.7,15.43 12.7,18.43 13.06,18.79 14.55,18.79 v14.8,19.04 | v25.62,13.76 26.61,13.76 27.69,14.84 U1.P$T2 | v21.25,23.52 21.11,23.66 21.11,24.61 20.26,25.47 v20.26,26.18
  other vias: 27.69,15.14
PREVGH  (via drill 0.35)
  Top 0.3: EPD_C9.2 12.5,11.39 11.83,12.06 11.83,12.55 11.2,13.19 10.7,13.19 J1.21 10.55,13.33 10.15,13.33 8.28,15.2 8.28,22.8 v8.72,23.24 | D5.1 11.79,28.46 10.18,26.86 v10.18,25.53
  Bottom 0.3: v10.18,25.53 9.88,25.53 8.68,24.33 8.68,23.27 v8.72,23.24
PREVGL  (via drill 0.35)
  Top 0.3: EPD_C11.2 9.92,9.28 9.92,11.95 10.16,12.19 10.55,12.19 J1.23 10.23,12.26 7.85,14.64 7.85,23.3 v7.84,23.32 | D2.2 v8.29,32.05 v8.28,32.04
  Bottom 0.3: v7.84,23.32 7.81,23.34 7.81,31.57 v8.28,32.04
RESE
  Top 0.3: R1_EP_DR.2 16.06,31.25 Q3.2 14.25,29.43 13.36,29.43 10.81,26.88 10.81,24.33 10,23.52 10,22.5 10.16,22.33 10.55,22.33 J1.3
RESET  (via drill 0.15, 0.35)
  Top 0.15: v37.3,13.2 37.5,12.99 38.76,12.99 39.16,12.59 39.58,12.59 J2.6 40.72,11.45 40.72,10.61 41.07,10.27 41.91,10.27 42.35,9.82 43.84,9.82 44.99,8.67 v44.99,6.1 | v40.76,6.08 40.76,4.39 TP_RESET.TP
  Bottom 0.15: U1.P$AC13 30.44,13.27 30.9,12.81 31.43,12.81 32.26,11.97 32.26,10.44 32.73,9.97 34.76,9.97 36.64,11.86 36.64,12.12 37.3,12.77 v37.3,13.2 | v44.99,6.1 40.77,6.1 v40.76,6.08
  other vias: 30.44,13.39
SCK  (via drill 0.35)
  Top 0.15: v22.98,17.2 22.81,17.38 12.25,17.38 12.13,17.26 J1.13 | v30.52,20.14 30.52,19.73 U1.P$A12
  Bottom 0.15: v22.98,17.2 26.56,20.78 30.15,20.78 30.52,20.41 v30.52,20.14
SCL  (via drill 0.15, 0.35)
  Top 0.15: IC3.12 19.51,12.29 19.51,12.23 19.63,12.11 20.59,12.11 v20.99,11.71 | v25.46,15.32 24.84,14.7 22.75,14.7 v21.14,13.1 | U3.7 19.62,20.3 v20,19.92 20.22,19.92 20.69,19.45 21.07,19.45 21.33,19.71 21.33,20.09 21.29,20.13 21.29,22.53 23.34,24.58 34.49,24.58 35.13,25.21 v35.13,25.32 | IC1.B1 35.61,32.42 35.7,32.42 36.36,31.77 36.36,30.76 R17.2 R4.1 35.35,30.35 35.32,30.35 35.07,30.1 35.07,26.78 v34.53,26.23 | v19.63,7.39 19.33,7.69 8.31,7.69 7.59,8.41 4.98,8.41 IC2.C1 5.03,8.77 7.55,8.77 v7.84,9.06 | v8.12,6.06 6.69,4.63 6.69,2.43 6.3,2.03 4.3,2.03 2.92,3.42 TP_SCL.TP
  Bottom 0.15: v25.46,15.32 26.7,15.32 27.52,16.14 U1.P$M2 | v20,19.92 20.08,19.84 20.08,17.63 21.14,16.56 v21.14,13.1 20.99,12.94 v20.99,11.71 20.43,11.15 20.43,8.77 19.63,7.96 v19.63,7.39 | v8.12,6.06 7.84,6.34 v7.84,9.06 | v35.13,25.32 35.13,25.63 v34.53,26.23
  other vias: 27.69,16.14
SDA  (via drill 0.15, 0.35)
  Top 0.15: IC3.2 20.03,13.11 20.47,13.11 22.51,15.15 v23.13,15.15 | v23.86,16.74 23.97,16.74 23.99,16.73 26.85,16.73 U1.P$L1 | U3.8 20.12,20.66 v20.88,19.9 20.88,22.52 21.7,23.33 21.7,24.2 22.36,24.86 33.92,24.86 36.73,27.66 R2.1 R18.2 36.68,29.52 36.68,31.83 35.65,32.86 IC1.C1 | v7.14,7.96 7.66,7.96 8.68,6.93 19.82,6.93 20.28,7.39 v22.64,7.39 | TP_SDA.TP 5.53,3.87 5.53,4.44 v7.14,6.05
  Bottom 0.15: v23.13,15.15 23.86,15.88 v23.86,16.74 | v23.13,15.15 21.95,16.32 21.77,16.32 20.88,17.22 v20.88,19.9 | v23.13,15.15 22.99,15.01 22.99,7.98 22.64,7.63 v22.64,7.39 | IC2.B2 4.38,8.01 7.08,8.01 v7.14,7.96 v7.14,7.95 v7.14,6.05
  other vias: 4.32,8.07
SWDCLK  (via drill 0.35)
  Top 0.15: J2.4 39.63,10.86 38.76,9.99 37.52,9.99 36.64,10.87 36.64,12.61 36.13,13.12 34.46,13.12 U1.P$AA24 33.97,13.61 34.57,13.61 34.83,13.87 v35.26,13.87 | TP_SWDCLK.TP 34.71,9.12 34.71,10.6 v34.98,10.88
  Bottom 0.15: v34.98,10.88 34.98,11.24 35.35,11.61 35.35,12.05 35.26,12.14 v35.26,13.87
SWDIO
  Top 0.15: U1.P$AC24 34.23,12.84 36.02,12.84 36.36,12.5 36.36,7.97 37.52,6.82 38.76,6.82 39.64,7.7 39.64,9.19 J2.2 40.04,8.83 39.87,8.65 39.87,6.34 TP_SWDIO.TP
SWO
  Top 0.15: TP_SWO.TP 32.23,9.23 32.23,12.43 U1.P$AD22
VBAT  (via drill 0.35)
  Top 0.3: IC1.C2 34.62,32.86 34.02,32.26 34.02,31.19 33.92,31.09 33.92,29.48 33.8,29.36 33.8,27.01 32.27,25.48 22,25.48 20.87,24.36 19.97,24.36 19.64,24.03 19.64,22.99 U3.2 U3.3 19.15,23 C27.2 C37.2 19.48,24.55 v19.8,24.87 | TP_VBAT.TP 18.71,2.73 v15.67,5.77
  Bottom 0.3: v15.67,5.77 15.07,6.37 13.47,6.37 8.17,11.66 8.17,15.94 17.11,24.87 v19.8,24.87
VBUS  (via drill 0.35)
  Top 0.3: J4.A9_B4 20.82,29.26 20.82,30.49 21.85,31.52 24.19,31.52 25.19,30.52 25.19,29.82 25.4,29.61 J4.A4_B9 | J4.A4_B9 25.62,28.81 25.62,27.51 25.83,27.31 28.33,27.31 28.58,27.56 28.58,28.35 28.74,28.51 28.97,28.51 C42.1 | C43.1 29.07,29.19 C42.1 | C43.1 30.62,31.15 31.08,31.15 31.24,31.31 31.24,31.39 32.52,32.67 D3.5 | IC1.A2 35.17,31.46 v35.08,31.37 | v30.24,29.92 29.71,29.39 28.88,29.39 C43.1 | C38.2 C42.1 | U1.P$AD2 27.57,12.78 C21.1 25.51,12.18 v25.51,9.83 | J4.A4_B9 25.18,28.81 25.18,27.46 24.61,26.89 23.56,26.89 v23.23,27.23 | v19.91,10.17 24.13,10.17 v24.17,10.21
  Bottom 0.3: v35.08,31.37 31.7,31.37 v30.24,29.92 | v24.17,10.21 25.13,10.21 v25.51,9.83 | v23.23,27.23 21.89,25.89 21.89,21.95 20.93,20.99 14.75,20.99 14.18,20.42 13.34,20.42 11.94,19.02 11.94,12.96 14.73,10.17 v19.91,10.17
VREG  (via drill 0.35)
  Top 0.15: IC1.B2 34.82,32.46 34.67,32.31
  Top 0.3: C24.2 31.32,30.45 C23.2 32.7,30.45 32.72,30.42 32.72,30.41 | 34.67,32.31 34.45,32.09 34.45,31.02 34.35,30.92 34.35,29.16 v34.32,29.14 | IC9.A3 IC9.A2 IC9.A1 37.42,33.06 v36.46,34.01 | 32.72,30.41 v32.74,30.41 | 32.72,30.41 32.72,27.85 C39.1 31.02,27.26 30.23,26.47 23.24,26.47 23,26.71 v21.91,26.71 | v8.83,5.46 8.04,4.67 TP_VREG.TP
  Bottom 0.3: v36.46,34.01 36.46,31.15 34.45,29.14 v34.32,29.14 33.05,30.41 v32.74,30.41 | v21.91,26.71 20.48,26.71 18.33,26.71 7.64,16.03 7.64,10 9.46,8.19 9.46,6.76 8.83,6.13 v8.83,5.46
(copper drawn outside any net)
  shapes: Bottom area x2, GND area x1, Top area x1